# Altium project SAM_E54_Xplained_Pro.PrjPCB (part 2 of 4)

## Sheet SAM_E54_Xplained_Pro_triple_input_power_supply_HSW.SchDoc: Power supply
size A3; Organization: ATMEL Norway; Address1: Vestre Rosten 79; Address2: N-7075 TILLER; Address3: NORWAY; DocumentNumber: A09-2748; Revision: 4; SheetNumber: 2; SheetTotal: 13; PageSetup: Record=PageOptions|CenterHorizontal=True|CenterVertical=True|PrintScale=1.01|XCorrection=1.00|YCorrection=1.00|PrintKind=1|BorderSize=5000000|LeftOffset=0|BottomOffset=0|Orientation=2|PaperLength=1000|PaperWidth=1000|Scale=100|PaperSource=7|PrintQuality=-4|MediaType=1|DitherType=10|PaperKind=A3 (297 x 420 mm)|PrintScaleMode=1
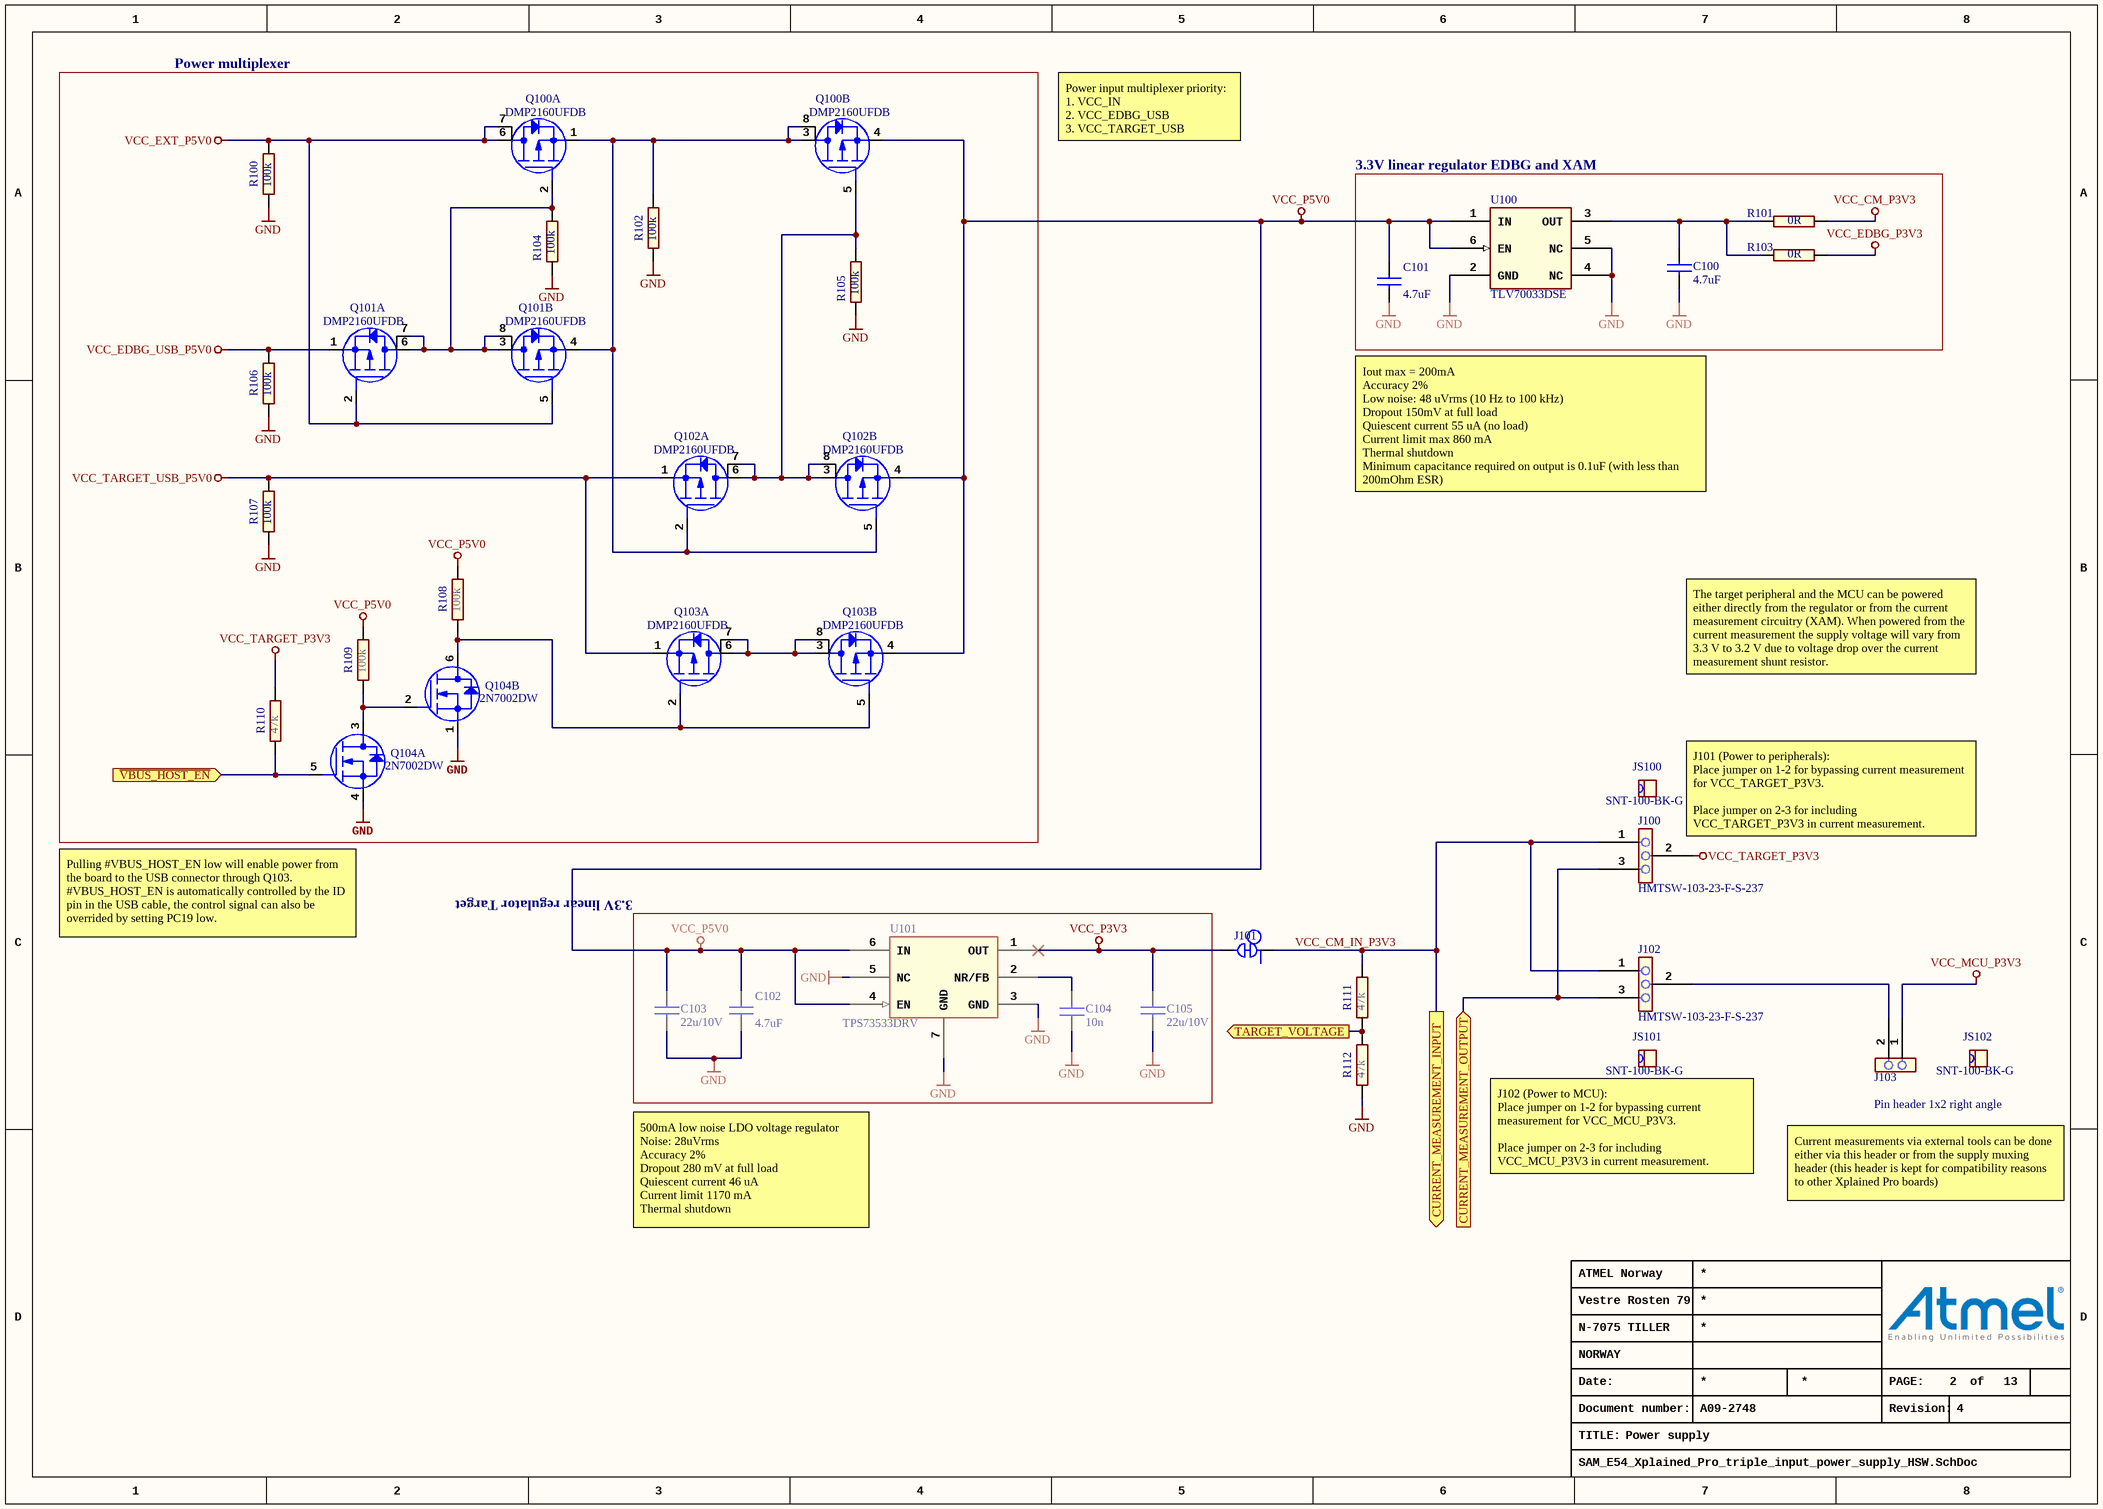
[diagram p4: SAM_E54_Xplained_Pro_triple_input_power_supply_HSW.SchDoc]

### Parts
C100  value 4.7uF  [AP1-00117]
C101  value 4.7uF  [AP1-00117]
C102  value 4.7uF  [AP1-00117]
C103  value 22u/10V  [AP1-00117]
C104  value 10n  [AP1-00053]
C105  value 22u/10V  [AP1-00117]
J100  value HMTSW-103-23-F-S-237  [AP8-00745]
J101  (no value)  [AP9-00044]  (net tie, no BOM)
J102  value HMTSW-103-23-F-S-237  [AP8-00745]
J103  value Pin header 1x2 right angle  [AP8-00367]
JS100  value SNT-100-BK-G  [AP8-00525]
JS101  value SNT-100-BK-G  [AP8-00525]
JS102  value SNT-100-BK-G  [AP8-00525]
Q100  value DMP2160UFDB  [AP5-00047]  (parts A,B of 2)
Q101  value DMP2160UFDB  [AP5-00047]  (parts A,B of 2)
Q102  value DMP2160UFDB  [AP5-00047]  (parts A,B of 2)
Q103  value DMP2160UFDB  [AP5-00047]  (parts A,B of 2)
Q104  value 2N7002DW  [AP5-00001]  (hidden comment: Same as 2N7002 but with two MOSFETs in one package)  (parts A,B of 2)
R100  value 100k  [AP2-00011]
R101  value 0R  [AP2-00011]
R102  value 100k  [AP2-00011]
R103  value 0R  [AP2-00011]
R104  value 100k  [AP2-00011]
R105  value 100k  [AP2-00011]
R106  value 100k  [AP2-00011]
R107  value 100k  [AP2-00011]
R108  value 100k  [AP2-00011]
R109  value 100k  [AP2-00011]
R110  value 47k  [AP2-00011]
R111  value 47k  [AP2-00011]
R112  value 47k  [AP2-00011]
U100  value TLV70033DSE  [AP6-00262]
U101  value TPS73533DRV  [AP6-00162]

### Blocks framed on the sheet
Power multiplexer: Q100-Q104 R100 R102 R104-R110
3.3V linear regulator EDBG and XAM: C100 C101 R101 R103 U100
3.3V linear regulator Target: C102-C105 U101

### Ports
CURRENT_MEASUREMENT_INPUT (out), CURRENT_MEASUREMENT_OUTPUT (in), TARGET_VOLTAGE (out), ~{VBUS_HOST_EN} (in)

### Nets
GND: C100.2 C101.2 C102.2 C103.2 C104.1 C105.2 Q104.1(S2) Q104.4(S1) R100.1 R102.1 R104.2 R105.1 R106.1 R107.1 R112.1 U100.2(GND) U100.4(NC) U100.5(NC) U101.3(GND) U101.5(NC) U101.7(GND)
VCC_CM_P3V3: R101.1
VCC_EDBG_P3V3: R103.1
VCC_EDBG_USB_P5V0: Q101.1(S1) R106.2
VCC_EXT_P5V0: Q100.6(D1) Q100.7(D1_PAD) Q101.2(G1) Q101.5(G2) R100.2
VCC_MCU_P3V3: J103.1
VCC_P3V3: C105.1 J101.2 U101.1(OUT)
VCC_P5V0: C101.1 C102.1 C103.1 Q100.4(S2) Q102.4(S2) Q103.4(S2) R108.2 R109.2 U100.1(IN) U100.6(EN) U101.4(EN) U101.6(IN)
VCC_TARGET_P3V3: J100.2 R110.2
VCC_TARGET_USB_P5V0: Q102.1(S1) Q103.1(S1) R107.2
CM_PA09_AIN17: R111.1 R112.2 ; port TARGET_VOLTAGE
VCC_CM_IN_P3V3: J100.1 J101.1 J102.1 R111.2 ; port CURRENT_MEASUREMENT_INPUT
NetC100_1: C100.1 R101.2 R103.2 U100.3(OUT)
NetC104_2: C104.2 U101.2(NR/FB)
NetJ100_3: J100.3 J102.3 ; port CURRENT_MEASUREMENT_OUTPUT
NetJ102_2: J102.2 J103.2
NetJ303_4: Q104.5(G1) R110.1 ; port ~{VBUS_HOST_EN}
NetQ100_1: Q100.1(S1) Q100.3(D2) Q100.8(D2_PAD) Q101.4(S2) Q102.2(G1) Q102.5(G2) R102.2
NetQ100_2: Q100.2(G1) Q101.3(D2) Q101.6(D1) Q101.7(D1_PAD) Q101.8(D2_PAD) R104.1
NetQ100_5: Q100.5(G2) Q102.3(D2) Q102.6(D1) Q102.7(D1_PAD) Q102.8(D2_PAD) R105.2
NetQ103_2: Q103.2(G1) Q103.5(G2) Q104.6(D2) R108.1
NetQ103_3: Q103.3(D2) Q103.6(D1) Q103.7(D1_PAD) Q103.8(D2_PAD)
NetQ104_2: Q104.2(G2) Q104.3(D1) R109.1

### Notes on the sheet
- Power input multiplexer priority:
  1. VCC_IN
  2. VCC_EDBG_USB
  3. VCC_TARGET_USB
- Iout max = 200mA
  Accuracy 2%
  Low noise: 48 uVrms (10 Hz to 100 kHz)
  Dropout 150mV at full load
  Quiescent current 55 uA (no load)
  Current limit max 860 mA
  Thermal shutdown
  Minimum capacitance required on output is 0.1uF (with less than 200mOhm ESR)
- The target peripheral and the MCU can be powered either directly from the regulator or from the current measurement circuitry (XAM). When powered from the current measurement the supply voltage will vary from 3.3 V to 3.2 V due to voltage drop over the current measurement shunt resistor.
- J101 (Power to peripherals):
  Place jumper on 1-2 for bypassing current measurement for VCC_TARGET_P3V3.
  Place jumper on 2-3 for including VCC_TARGET_P3V3 in current measurement.
- Pulling #VBUS_HOST_EN low will enable power from the board to the USB connector through Q103.
  #VBUS_HOST_EN is automatically controlled by the ID pin in the USB cable, the control signal can also be overrided by setting PC19 low.
- (near JS101) J102 (Power to MCU):
  Place jumper on 1-2 for bypassing current measurement for VCC_MCU_P3V3.
  Place jumper on 2-3 for including VCC_MCU_P3V3 in current measurement.
- 500mA low noise LDO voltage regulator
  Noise: 28uVrms
  Accuracy 2%
  Dropout 280 mV at full load
  Quiescent current 46 uA
  Current limit 1170 mA
  Thermal shutdown
- Current measurements via external tools can be done either via this header or from the supply muxing header (this header is kept for compatibility reasons to other Xplained Pro boards)
- Date:
- PAGE:
- of
- TITLE:
- Document number:
- Revision:

### Library data of the parts
C100-C102 = A01-0377: Ceramic capacitor, SMD 0603, X5R, 10V, 10% (de31036); PartGroup: Capacitors,Ceramic,SMD 0603; Manufacturer: WALSIN Technology Corporation; MPN: 0603X475K100CT; TemperatureRange: -55 - +85 deg C; AN: A01-0377; Tolerance: 10%; Height: 0,800000011920929
C103 C105 = A01-0791: Ceramic capacitor, SMD 0603, X5R,10V, Â±20%; PartGroup: Capacitors,Ceramic,SMD 0603; Manufacturer: Murata; MPN: GRM188R61A226ME15D; AN: A01-0791; Tolerance: Â±20%
C104 = A01-0050: Ceramic capacitor, SMD 0402, X7R, 25V, +/-10%; PartGroup: Capacitors,Ceramic,SMD 0402; Manufacturer: YAGEO CORP; MPN: CC0402KRX7R8BB103; TemperatureRange: -55 - +125 deg C; AN: A01-0050; Tolerance: 25V, +/-10%; Height: 0,550000011920929
J100 J102 = A08-1799: 1x3 pin header, 2.54mm pitch, Pin-in-Paste THM, 1mm hole; PartGroup: Mechanical devices,Connectors,Pin headers; Manufacturer: SAMTEC; AN: A08-1799; Height: 6,09999990463257; MPN: HMTSW-103-23-F-S-237
J101 = A09-0783: Default closed SMD strap, 0603 size; PartGroup: Mechanical devices,PCB implemented components; Value: SMD-STRAP_0603_CLOSED; AN: A09-0783; Height: 0
J103 = A08-0764: 1x2 pin header, right angle, 2.54 mm pitch, through-hole; PartGroup: Mechanical devices,Connectors,Pin headers; Manufacturer: Pro-data International Corp; MPN: 2213R-2G; AN: A08-0764; Height: 2,53999996185303
JS100-JS102 = A08-0543: Jumper cap for 2.54mm pinheader; PartGroup: Mechanical devices,Mounting accessories,Other; Manufacturer: SAMTEC; AN: A08-0543; MPN: SNT-100-BK-G
Q100-Q103 = A05-0171: MOSFET 20V 3.8A DUAL P-CHAN, Rds 70 mOhms, Vgs 12V, Vds -20; PartGroup: Transistors,Power FET,SMD; Manufacturer: Diodes Incorporated; MPN: DMP2160UFDB-7; TemperatureRange: -55 C to +150 C; AN: A05-0171; Height: 0,605000019073486
Q104 = A05-0051: Dual N-Channel MOSFET, 60V, 115mA cont,RDS(ON) < 7.5 Ohm @50mA@5V, SOT-363; PartGroup: Transistors,Small signal FET,SMD; Manufacturer: Fairchild; TemperatureRange: -65 to 150 deg C; AN: A05-0051; Height: 1,10000002384186; MPN: 2N7002DW
R100 R102 R104-R109 = A02-0260: Thick film resistor, SMD 0402, 1/16W, 1%; PartGroup: Resistors,SMD,0402 1%; Manufacturer: ASJ; MPN: CR10-1003-FK; TemperatureRange: -55ï¿½ to +125ï¿½C; AN: A02-0260; Tolerance: 1 %; Height: 0,349999994039536
R101 R103 = A02-0163: RES 0.0 OHM 1/16W 0402 SMD; PartGroup: Resistors,SMD,0402 1%; Manufacturer: (n/a); MPN: RMCF0402ZT0R00; Tolerance: 1 %; TemperatureRange: -55 - +125 deg C; AN: A02-0163; Height: 0,349999994039536
R110-R112 = A02-0252: Thick film resistor, SMD 0402, 1/16W, 1%; PartGroup: Resistors,SMD,0402 1%; Manufacturer: KOA; MPN: RK73H1ETTP4702F; TemperatureRange: -55 - +125 deg C; AN: A02-0252; Tolerance: 1 %; Height: 0,349999994039536
U100 = A06-0719: LDO, 200 mA, Iq=31 uA, Vdo=250mV, Vout=3.3V, VIN= 2 V to 5.5V, SON-6 package; PartGroup: Integrated Circuits,Regulators,Linear; Manufacturer: Texas Instruments; AN: A06-0719; Height: 0,800000011920929; MPN: TLV70033DSE
U101 = A06-1135: Low noise LDO, 500 mA, Vout=3.3V, 2% accuracy, IQ=46uA, noise=28uVrms, VIN= 2.7V to 6.5V, Vdo=280mV,stable with low ESR capacitor; PartGroup: Integrated Circuits,Regulators,Linear; Manufacturer: Texas Instruments; AN: A06-1135; Height: 0,75; MPN: TPS73533DRV

## Sheet SAM_E54_Xplained_Pro_current_measurement.SchDoc: Current measurement
size A3; Organization: ATMEL Norway; Address1: Vestre Rosten 79; Address2: N-7075 TILLER; Address3: NORWAY; DocumentNumber: A09-2748; Revision: 4; SheetNumber: 10; SheetTotal: 13; PageSetup: Record=PageOptions|CenterHorizontal=True|CenterVertical=True|PrintScale=1.01|XCorrection=1.00|YCorrection=1.00|PrintKind=1|BorderSize=5000000|LeftOffset=0|BottomOffset=0|Orientation=2|PaperLength=1000|PaperWidth=1000|Scale=100|PaperSource=7|PrintQuality=-4|MediaType=1|DitherType=10|PaperKind=A3 (297 x 420 mm)|PrintScaleMode=1
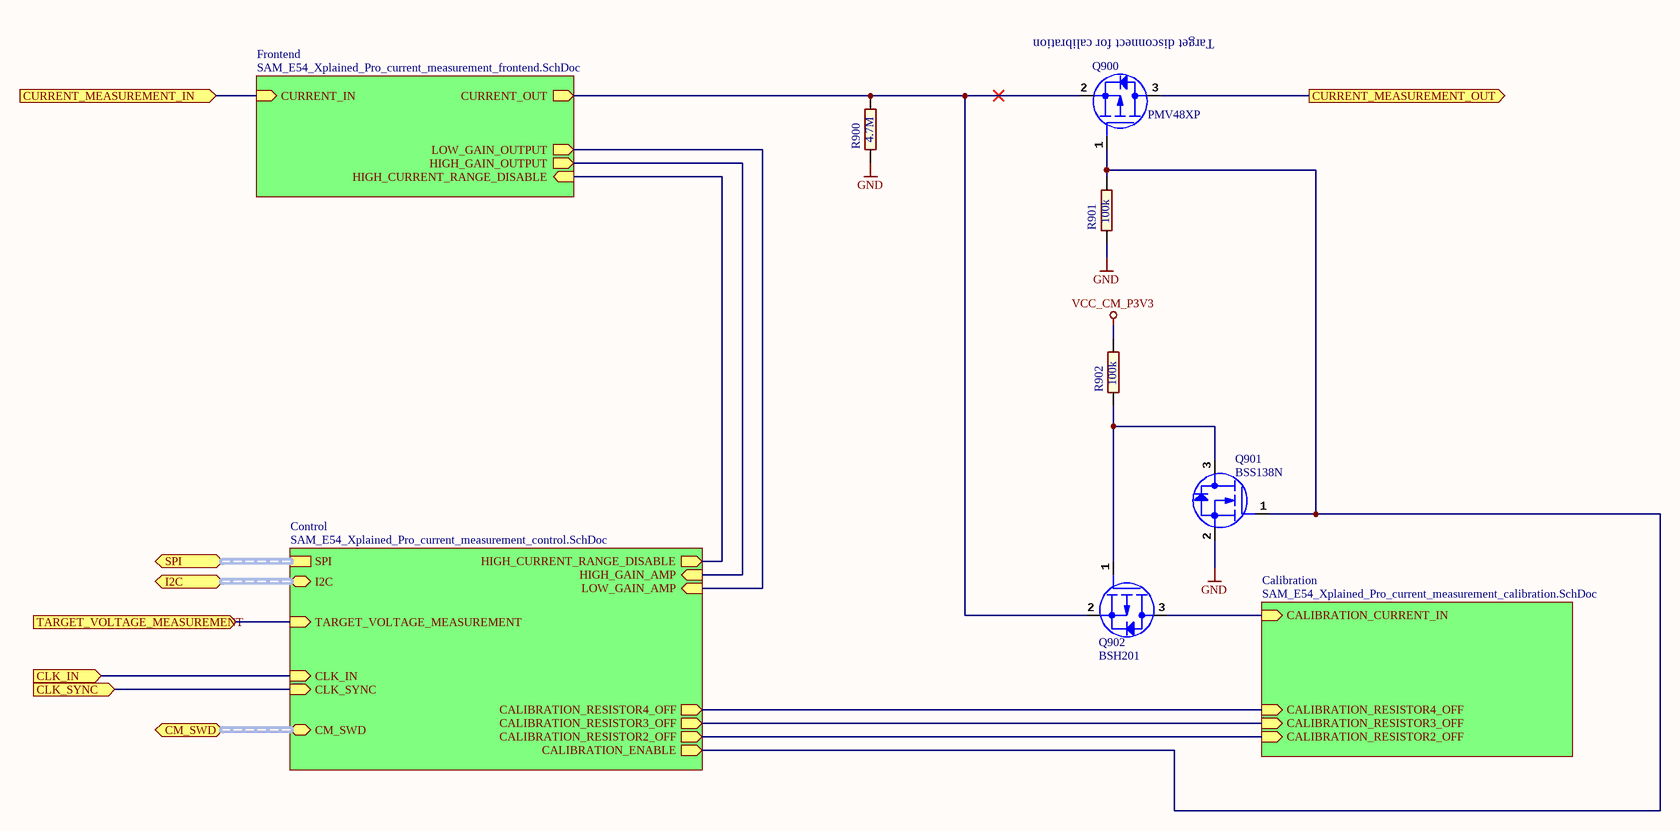
[diagram p5: SAM_E54_Xplained_Pro_current_measurement.SchDoc]

### Parts
Q900  value PMV48XP  [AP5-00002]
Q901  value BSS138N  [AP5-00002]
Q902  value BSH201  [AP5-00002]
R900  value 4.7M  [AP2-00011]
R901  value 100k  [AP2-00011]
R902  value 100k  [AP2-00011]

### Sub-sheets
Calibration = SAM_E54_Xplained_Pro_current_measurement_calibration.SchDoc: CALIBRATION_RESISTOR2_OFF (in), CALIBRATION_RESISTOR3_OFF (in), CALIBRATION_RESISTOR4_OFF (in), CALIBRATION_CURRENT_IN (in)
Control = SAM_E54_Xplained_Pro_current_measurement_control.SchDoc: LOW_GAIN_AMP (in), HIGH_GAIN_AMP (in), HIGH_CURRENT_RANGE_DISABLE (out), SPI (harness SPI), CALIBRATION_RESISTOR3_OFF (out), CALIBRATION_RESISTOR2_OFF (out), CALIBRATION_ENABLE (out), CALIBRATION_RESISTOR4_OFF (out), I2C (harness I2C), CLK_IN (in), CLK_SYNC (in), TARGET_VOLTAGE_MEASUREMENT (in), CM_SWD (harness SWD)
Frontend = SAM_E54_Xplained_Pro_current_measurement_frontend.SchDoc: CURRENT_OUT (out), CURRENT_IN (in), LOW_GAIN_OUTPUT (out), HIGH_GAIN_OUTPUT (out), HIGH_CURRENT_RANGE_DISABLE (in)

### Ports
CLK_IN (in), CLK_SYNC (in), CM_SWD (harness SWD), CURRENT_MEASUREMENT_IN (in), CURRENT_MEASUREMENT_OUT (out), I2C (harness I2C), SPI (harness SPI), TARGET_VOLTAGE_MEASUREMENT (in)

### Nets
GND: Q901.2(S) R900.1 R901.1
VCC_CM_P3V3: R902.2
CM_PA00_GPIO: sheet Calibration/CALIBRATION_RESISTOR3_OFF, sheet Control/CALIBRATION_RESISTOR3_OFF
CM_PA01_GPIO: sheet Calibration/CALIBRATION_RESISTOR4_OFF, sheet Control/CALIBRATION_RESISTOR4_OFF
CM_PA05_AIN5: sheet Control/LOW_GAIN_AMP, sheet Frontend/LOW_GAIN_OUTPUT
CM_PA08_AIN16: sheet Control/HIGH_GAIN_AMP, sheet Frontend/HIGH_GAIN_OUTPUT
CM_PA09_AIN17: port TARGET_VOLTAGE_MEASUREMENT, sheet Control/TARGET_VOLTAGE_MEASUREMENT
CM_PA10_GPIO: Q900.1(G) Q901.1(G) R901.2 ; sheet Control/CALIBRATION_ENABLE
CM_PA11_GCLK5: port CLK_SYNC, sheet Control/CLK_SYNC
CM_PA14_GCLK0: port CLK_IN, sheet Control/CLK_IN
CM_PA15_GPIO: sheet Calibration/CALIBRATION_RESISTOR2_OFF, sheet Control/CALIBRATION_RESISTOR2_OFF
CM_PA18_CMP0: sheet Control/HIGH_CURRENT_RANGE_DISABLE, sheet Frontend/HIGH_CURRENT_RANGE_DISABLE
VCC_CM_IN_P3V3: port CURRENT_MEASUREMENT_IN, sheet Frontend/CURRENT_IN
NetJ100_3: Q900.3(D) ; port CURRENT_MEASUREMENT_OUT
NetQ900_2: Q900.2(S) Q902.2(S) R900.2 ; sheet Frontend/CURRENT_OUT
NetQ901_3: Q901.3(D) Q902.1(G) R902.1
NetQ902_3: Q902.3(D) ; sheet Calibration/CALIBRATION_CURRENT_IN

### Buses and harness runs
harness port CM_SWD = sheet Control/CM_SWD
harness port I2C = sheet Control/I2C
harness port SPI = sheet Control/SPI

### Notes on the sheet
- (near Q900) Target disconnect for calibration
- Date:
- PAGE:
- of
- TITLE:
- Document number:
- Revision:

### Library data of the parts
Q900 = A05-0130: P-Channel Digital FET. -30V, -3.5A continuous, -14A Peak. RDS(ON)=48mOhm@VGS=-4.5V, RDS(ON)=71mOhm@VGS=-2.5V. VGS(th)<1.25V; PartGroup: Transistors,Power FET,SMD; Manufacturer: NXP; MPN: PMV48XP,215; TemperatureRange: -55Â°C to +150Â°C; AN: A05-0130
Q901 = A05-0140: Low leakage N-Channel MOSFET. 60V, 0.23A continuous, 0.92A Peak. RDS(ON) = 3.5Ohm@VGS=4.5V, VGS(th)<1.4V; PartGroup: Transistors,Small signal FET,SMD; Manufacturer: Infineon; TemperatureRange: -55  to +150 deg celcius; AN: A05-0140; Height: 1,10000002384186; MPN: BSS138N
Q902 = A05-0132: P-Channel Digital FET. -60V, -0.3A continuous, -1.2A Peak. RDS(ON)=2.5@VGS=-10V, RDS(ON)=<5 ohm @VGS=-2.5V. VGS(th)<1.9V; PartGroup: Transistors,Small signal FET,SMD; Manufacturer: NXP; MPN: BSH201,215; AN: A05-0132
R900 = A02-0884: Thick film SMD 0402 1/16W 1%; PartGroup: Resistors,SMD,0402 1%; Manufacturer: YAGEO CORP; MPN: RC0402FR-074M7L; TemperatureRange: -55 Â°C to +155 Â°C; AN: A02-0884; Tolerance: 1 %
R901 R902 = A02-0260: as R100 on sheet SAM_E54_Xplained_Pro_triple_input_power_supply_HSW; AN: A02-0260; Tolerance: 1 %; Height: 0,349999994039536

## Sheet SAM_E54_Xplained_Pro_current_measurement_calibration.SchDoc: Current measurement calibration
size A3; Organization: ATMEL Norway; Address1: Vestre Rosten 79; Address2: N-7075 TILLER; Address3: NORWAY; DocumentNumber: A09-2748; Revision: 4; SheetNumber: 11; SheetTotal: 13; PageSetup: Record=PageOptions|CenterHorizontal=True|CenterVertical=True|PrintScale=1.01|XCorrection=1.00|YCorrection=1.00|PrintKind=1|BorderSize=5000000|LeftOffset=0|BottomOffset=0|Orientation=2|PaperLength=1000|PaperWidth=1000|Scale=100|PaperSource=7|PrintQuality=-4|MediaType=1|DitherType=10|PaperKind=A3 (297 x 420 mm)|PrintScaleMode=1
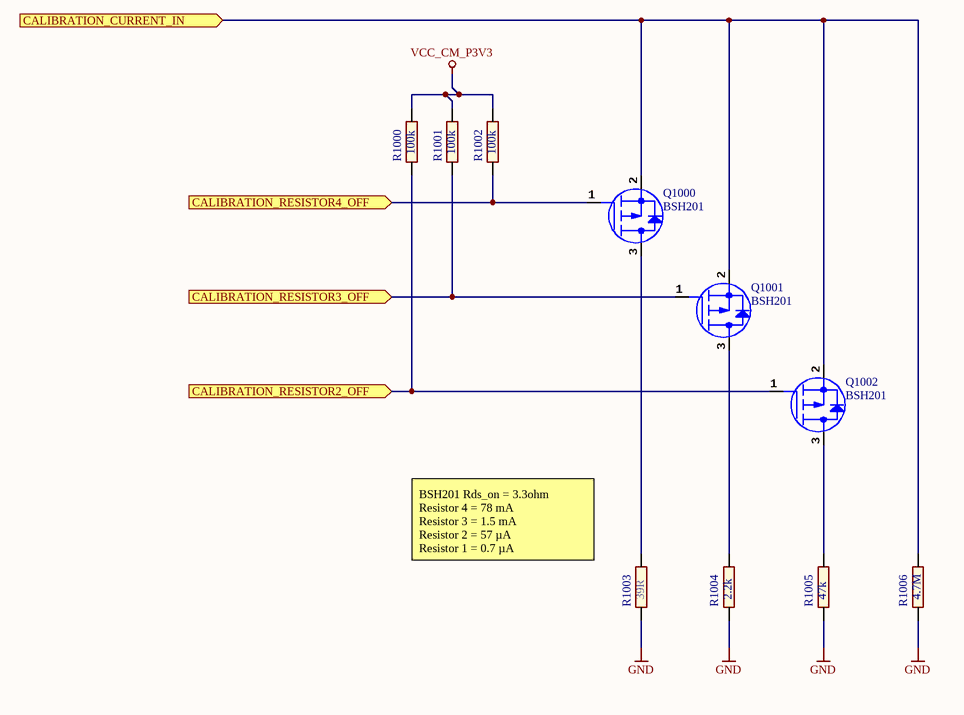
[diagram p6: SAM_E54_Xplained_Pro_current_measurement_calibration.SchDoc]

### Parts
Q1000  value BSH201  [AP5-00002]
Q1001  value BSH201  [AP5-00002]
Q1002  value BSH201  [AP5-00002]
R1000  value 100k  [AP2-00011]
R1001  value 100k  [AP2-00011]
R1002  value 100k  [AP2-00011]
R1003  value 39R  [AP2-00011]
R1004  value 2.2k  [AP2-00011]
R1005  value 47k  [AP2-00011]
R1006  value 4.7M  [AP2-00011]

### Ports
CALIBRATION_CURRENT_IN (in), CALIBRATION_RESISTOR2_OFF (in), CALIBRATION_RESISTOR3_OFF (in), CALIBRATION_RESISTOR4_OFF (in)

### Nets
GND: R1003.1 R1004.1 R1005.1 R1006.1
VCC_CM_P3V3: R1000.2 R1001.2 R1002.2
CM_PA00_GPIO: Q1001.1(G) R1001.1 ; port CALIBRATION_RESISTOR3_OFF
CM_PA01_GPIO: Q1000.1(G) R1002.1 ; port CALIBRATION_RESISTOR4_OFF
CM_PA15_GPIO: Q1002.1(G) R1000.1 ; port CALIBRATION_RESISTOR2_OFF
NetQ902_3: Q1000.2(S) Q1001.2(S) Q1002.2(S) R1006.2 ; port CALIBRATION_CURRENT_IN
NetQ1000_3: Q1000.3(D) R1003.2
NetQ1001_3: Q1001.3(D) R1004.2
NetQ1002_3: Q1002.3(D) R1005.2

### Notes on the sheet
- (near R1003) BSH201 Rds_on = 3.3ohm
  Resistor 4 = 78 mA
  Resistor 3 = 1.5 mA
  Resistor 2 = 57 µA
  Resistor 1 = 0.7 µA
- Date:
- PAGE:
- of
- TITLE:
- Document number:
- Revision:

### Library data of the parts
Q1000-Q1002 = A05-0132: as Q902 on sheet SAM_E54_Xplained_Pro_current_measurement; AN: A05-0132
R1000-R1002 = A02-0260: as R100 on sheet SAM_E54_Xplained_Pro_triple_input_power_supply_HSW; AN: A02-0260; Tolerance: 1 %; Height: 0,349999994039536
R1003 = A02-0178: Thick film resistor, SMD 0402, 1/16W, 1%; PartGroup: Resistors,SMD,0402 1%; Manufacturer: ASJ; MPN: CR10-39R0-FK; TemperatureRange: -55 - +125 deg C; AN: A02-0178; Tolerance: 1 %; Height: 0,349999994039536
R1004 = A02-0220: Thick film resistor, SMD 0402, 1/16W, 1%; PartGroup: Resistors,SMD,0402 1%; Manufacturer: ASJ; MPN: CR10-2201-FK; TemperatureRange: -55 - +125 deg C; AN: A02-0220; Tolerance: 1 %; Height: 0,349999994039536
R1005 = A02-0252: as R110 on sheet SAM_E54_Xplained_Pro_triple_input_power_supply_HSW; AN: A02-0252; Tolerance: 1 %; Height: 0,349999994039536
R1006 = A02-0884: as R900 on sheet SAM_E54_Xplained_Pro_current_measurement; AN: A02-0884; Tolerance: 1 %

## Sheet SAM_E54_Xplained_Pro_current_measurement_control.SchDoc: Current measurement control
size A3; Organization: ATMEL Norway; Address1: Vestre Rosten 79; Address2: N-7075 TILLER; Address3: NORWAY; DocumentNumber: A09-2748; Revision: 4; SheetNumber: 12; SheetTotal: 13; PageSetup: Record=PageOptions|CenterHorizontal=True|CenterVertical=True|PrintScale=1.01|XCorrection=1.00|YCorrection=1.00|PrintKind=1|BorderSize=5000000|LeftOffset=0|BottomOffset=0|Orientation=2|PaperLength=1000|PaperWidth=1000|Scale=100|PaperSource=7|PrintQuality=-4|MediaType=1|DitherType=10|PaperKind=A3 (297 x 420 mm)|PrintScaleMode=1
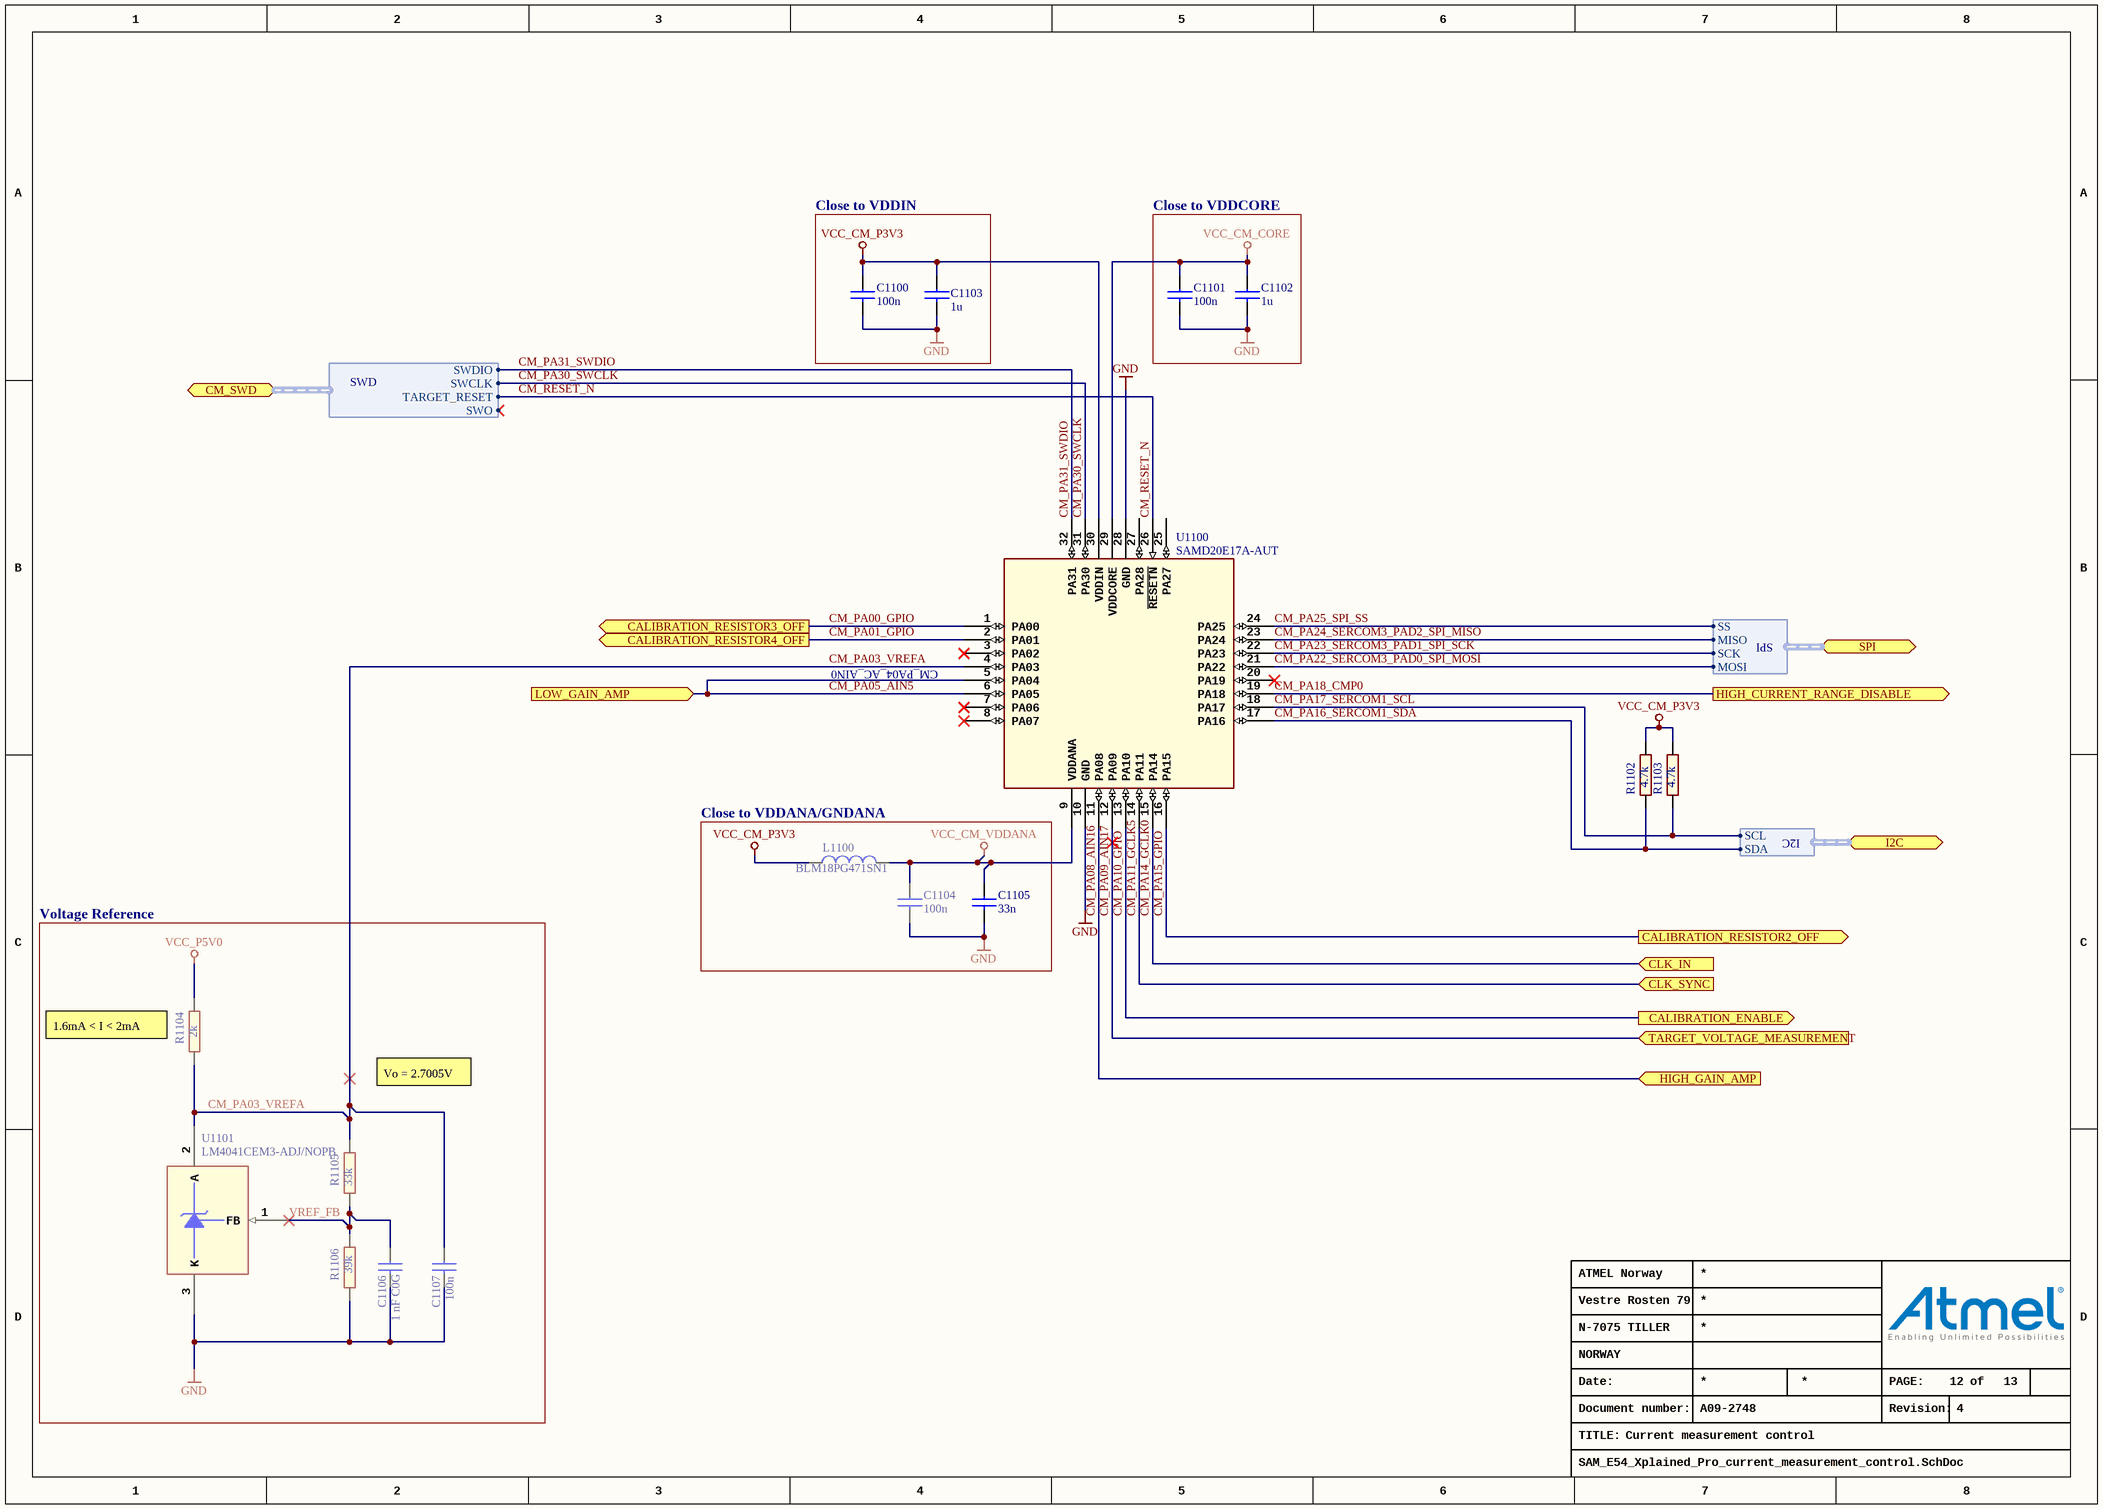
[diagram p7: SAM_E54_Xplained_Pro_current_measurement_control.SchDoc]

### Parts
C1100  value 100n  [AP1-00053]
C1101  value 100n  [AP1-00053]
C1102  value 1u  [AP1-00053]
C1103  value 1u  [AP1-00053]
C1104  value 100n  [AP1-00053]
C1105  value 33n  [AP1-00053]
C1106  value 1 nF C0G  [AP1-00053]
C1107  value 100n  [AP1-00053]
L1100  value BLM18PG471SN1  [AP3-00005]
R1102  value 4.7k  [AP2-00011]
R1103  value 4.7k  [AP2-00011]
R1104  value 2k  [AP2-00011]
R1105  value 33k  [AP2-00011]
R1106  value 39k  [AP2-00011]
U1100  value SAMD20E17A-AUT  [AP6-00061]
U1101  value LM4041CEM3-ADJ/NOPB  [AP5-00002]

### Blocks framed on the sheet
Close to VDDIN: C1100 C1103
Close to VDDCORE: C1101 C1102
Close to VDDANA/GNDANA: C1104 C1105 L1100
Voltage Reference: C1106 C1107 R1104-R1106 U1101

### Ports
CALIBRATION_ENABLE (out), CALIBRATION_RESISTOR2_OFF (out), CALIBRATION_RESISTOR3_OFF (out), CALIBRATION_RESISTOR4_OFF (out), CLK_IN (in), CLK_SYNC (in), CM_SWD (harness SWD), HIGH_CURRENT_RANGE_DISABLE (out), HIGH_GAIN_AMP (in), I2C (harness I2C), LOW_GAIN_AMP (in), SPI (harness SPI), TARGET_VOLTAGE_MEASUREMENT (in)

### Harnesses
SPI: MISO, MOSI, SCK, SS
I2C: SCL, SDA
SWD: SWCLK, SWDIO, TARGET_RESET, SWO

### Nets
GND: C1100.2 C1101.2 C1102.2 C1103.2 C1104.2 C1105.2 C1106.2 C1107.2 R1106.1 U1100.10(GND) U1100.28(GND) U1101.3(K)
VCC_CM_CORE: C1101.1 C1102.1 U1100.29(VDDCORE)
VCC_CM_P3V3: C1100.1 C1103.1 L1100.1 R1102.2 R1103.2 U1100.30(VDDIN)
VCC_CM_VDDANA: C1104.1 C1105.1 L1100.2 U1100.9(VDDANA)
VCC_P5V0: R1104.2
CM_PA00_GPIO: U1100.1(PA00) ; port CALIBRATION_RESISTOR3_OFF
CM_PA01_GPIO: U1100.2(PA01) ; port CALIBRATION_RESISTOR4_OFF
CM_PA03_VREFA: C1107.1 R1104.1 R1105.2 U1100.4(PA03) U1101.2(A)
CM_PA05_AIN5: U1100.5(PA04) U1100.6(PA05) ; port LOW_GAIN_AMP
CM_PA08_AIN16: U1100.11(PA08) ; port HIGH_GAIN_AMP
CM_PA09_AIN17: U1100.12(PA09) ; port TARGET_VOLTAGE_MEASUREMENT
CM_PA10_GPIO: U1100.13(PA10) ; port CALIBRATION_ENABLE
CM_PA11_GCLK5: U1100.14(PA11) ; port CLK_SYNC
CM_PA14_GCLK0: U1100.15(PA14) ; port CLK_IN
CM_PA15_GPIO: U1100.16(PA15) ; port CALIBRATION_RESISTOR2_OFF
CM_PA16_SERCOM1_SDA: R1102.1 U1100.17(PA16) ; port I2C.SDA
CM_PA17_SERCOM1_SCL: R1103.1 U1100.18(PA17) ; port I2C.SCL
CM_PA18_CMP0: U1100.19(PA18) ; port HIGH_CURRENT_RANGE_DISABLE
CM_PA22_SERCOM3_PAD0_SPI_MOSI: U1100.21(PA22) ; port SPI.MOSI
CM_PA23_SERCOM3_PAD1_SPI_SCK: U1100.22(PA23) ; port SPI.SCK
CM_PA24_SERCOM3_PAD2_SPI_MISO: U1100.23(PA24) ; port SPI.MISO
CM_PA25_SPI_SS: U1100.24(PA25) ; port SPI.SS
CM_PA30_SWCLK: U1100.31(PA30) ; port CM_SWD.SWCLK
CM_PA31_SWDIO: U1100.32(PA31) ; port CM_SWD.SWDIO
CM_RESET_N: U1100.26(~{RESETN}) ; port CM_SWD.TARGET_RESET
VREF_FB: C1106.1 R1105.1 R1106.2 U1101.1(FB)

Not connected (* = marked no-connect by the designer): U1100 3(PA02)* 7(PA06)* 8(PA07)* 20(PA19)* 25(PA27) 27(PA28)

### Notes on the sheet
- CM_PA04_AC_AIN0
- (near R1104) 1.6mA < I < 2mA
- Vo = 2.7005V
- Date:
- PAGE:
- of
- TITLE:
- Document number:
- Revision:

### Library data of the parts
C1100 C1101 C1104 C1107 = A01-0246: Ceramic capacitor, SMD 0402, X7R, 16V, +/-10%; PartGroup: Capacitors,Ceramic,SMD 0402; Manufacturer: Kemet; MPN: C0402C104K4RACTU; TemperatureRange: -55 - +125 deg C; AN: A01-0246; Tolerance: 16V, +/-10%; Height: 0,5
C1102 C1103 = A01-0286: Ceramic capacitor, SMD 0402, X5R, 6.3V, +/-10% (de26942); PartGroup: Capacitors,Ceramic,SMD 0402; Manufacturer: Kemet; MPN: C0402C105K9PAC; TemperatureRange: -55 to 85 deg C; AN: A01-0286; Tolerance: +/-10%; Height: 0,5
C1105 = A01-0397: Ceramic capacitor, SMD 0402, X7R, 25V, ±10%; PartGroup: Capacitors,Ceramic,SMD 0402; Manufacturer: Murata; MPN: GRM155R71E333KA88D; Tolerance: ±10%(K); TemperatureRange: -55 to 125°C; AN: A01-0397; Height: 0,5
C1106 = A01-0321: Ceramic capacitor, SMD 0402, C0G, 50V, +/-5%; PartGroup: Capacitors,Ceramic,SMD 0402; Manufacturer: Murata; MPN: GRM1555C1H102JA01D; Tolerance: 5%; AN: A01-0321; Height: 0,550000011920929
L1100 = A03-0035: SMD RF inductor 0603. Z=470Ohm (@100MHz), Max R(dc)=0.65Ohm, Max current=1A; PartGroup: Inductors,EMI; Manufacturer: Murata; TemperatureRange: -55; AN: A03-0035; Height: 0,800000011920929; MPN: BLM18PG471SN1
R1102 R1103 = A02-0228: Thick film resistor, SMD 0402, 1/16W, 1%; PartGroup: Resistors,SMD,0402 1%; Manufacturer: PHYCOMP; MPN: 2322 706 74702L; TemperatureRange: -55ï¿½ to +125ï¿½C; AN: A02-0228; Tolerance: 1 %; Height: 0,349999994039536
R1104 = A02-0219: Thick film resistor, SMD 0402, 1/16W, 1%; PartGroup: Resistors,SMD,0402 1%; TemperatureRange: -55 - +125 deg C; AN: A02-0219; Tolerance: 1 %; Height: 0,349999994039536
R1105 = A02-0248: Thick film resistor, SMD 0402, 1/16W, 1%; PartGroup: Resistors,SMD,0402 1%; Manufacturer: ASJ; MPN: CR10-3302-FK; TemperatureRange: -55 - +125 deg C; AN: A02-0248; Tolerance: 1 %; Height: 0,349999994039536
R1106 = A02-0250: Thick film resistor, SMD 0402, 1/16W, 1%; PartGroup: Resistors,SMD,0402 1%; Manufacturer: ASJ; MPN: CR10-3902-FK; TemperatureRange: -55 - +125 deg C; AN: A02-0250; Tolerance: 1 %; Height: 0,349999994039536
U1100 = A06-1023: Atmel 32bit RISC MCU 32 pin; PartGroup: Integrated Circuits,MCU, MPU, DSP,ARM MCU; MPN: ATSAMD20E17A-AUT; Design comment: *; AN: A06-1023; Height: 1,20000004768372; Manufacturer: ATMEL
U1101 = A06-0123: Adjustable shunt voltage regulator, 1.24 to 10V out; PartGroup: Integrated Circuits,Regulators,Voltage reference; Manufacturer: Texas Instruments; TemperatureRange: -40 to +85 deg. C; AN: A06-0123; Height: 1; MPN: LM4041CEM3-ADJ/NOPB

## Sheet SAM_E54_Xplained_Pro_current_measurement_frontend.SchDoc: Current measurement frontend
size A3; Organization: ATMEL Norway; Address1: Vestre Rosten 79; Address2: N-7075 TILLER; Address3: NORWAY; DocumentNumber: A09-2748; Revision: 4; SheetNumber: 13; SheetTotal: 13; PageSetup: Record=PageOptions|CenterHorizontal=True|CenterVertical=True|PrintScale=1.01|XCorrection=1.00|YCorrection=1.00|PrintKind=1|BorderSize=5000000|LeftOffset=0|BottomOffset=0|Orientation=2|PaperLength=1000|PaperWidth=1000|Scale=100|PaperSource=7|PrintQuality=-4|MediaType=1|DitherType=10|PaperKind=A3 (297 x 420 mm)|PrintScaleMode=1
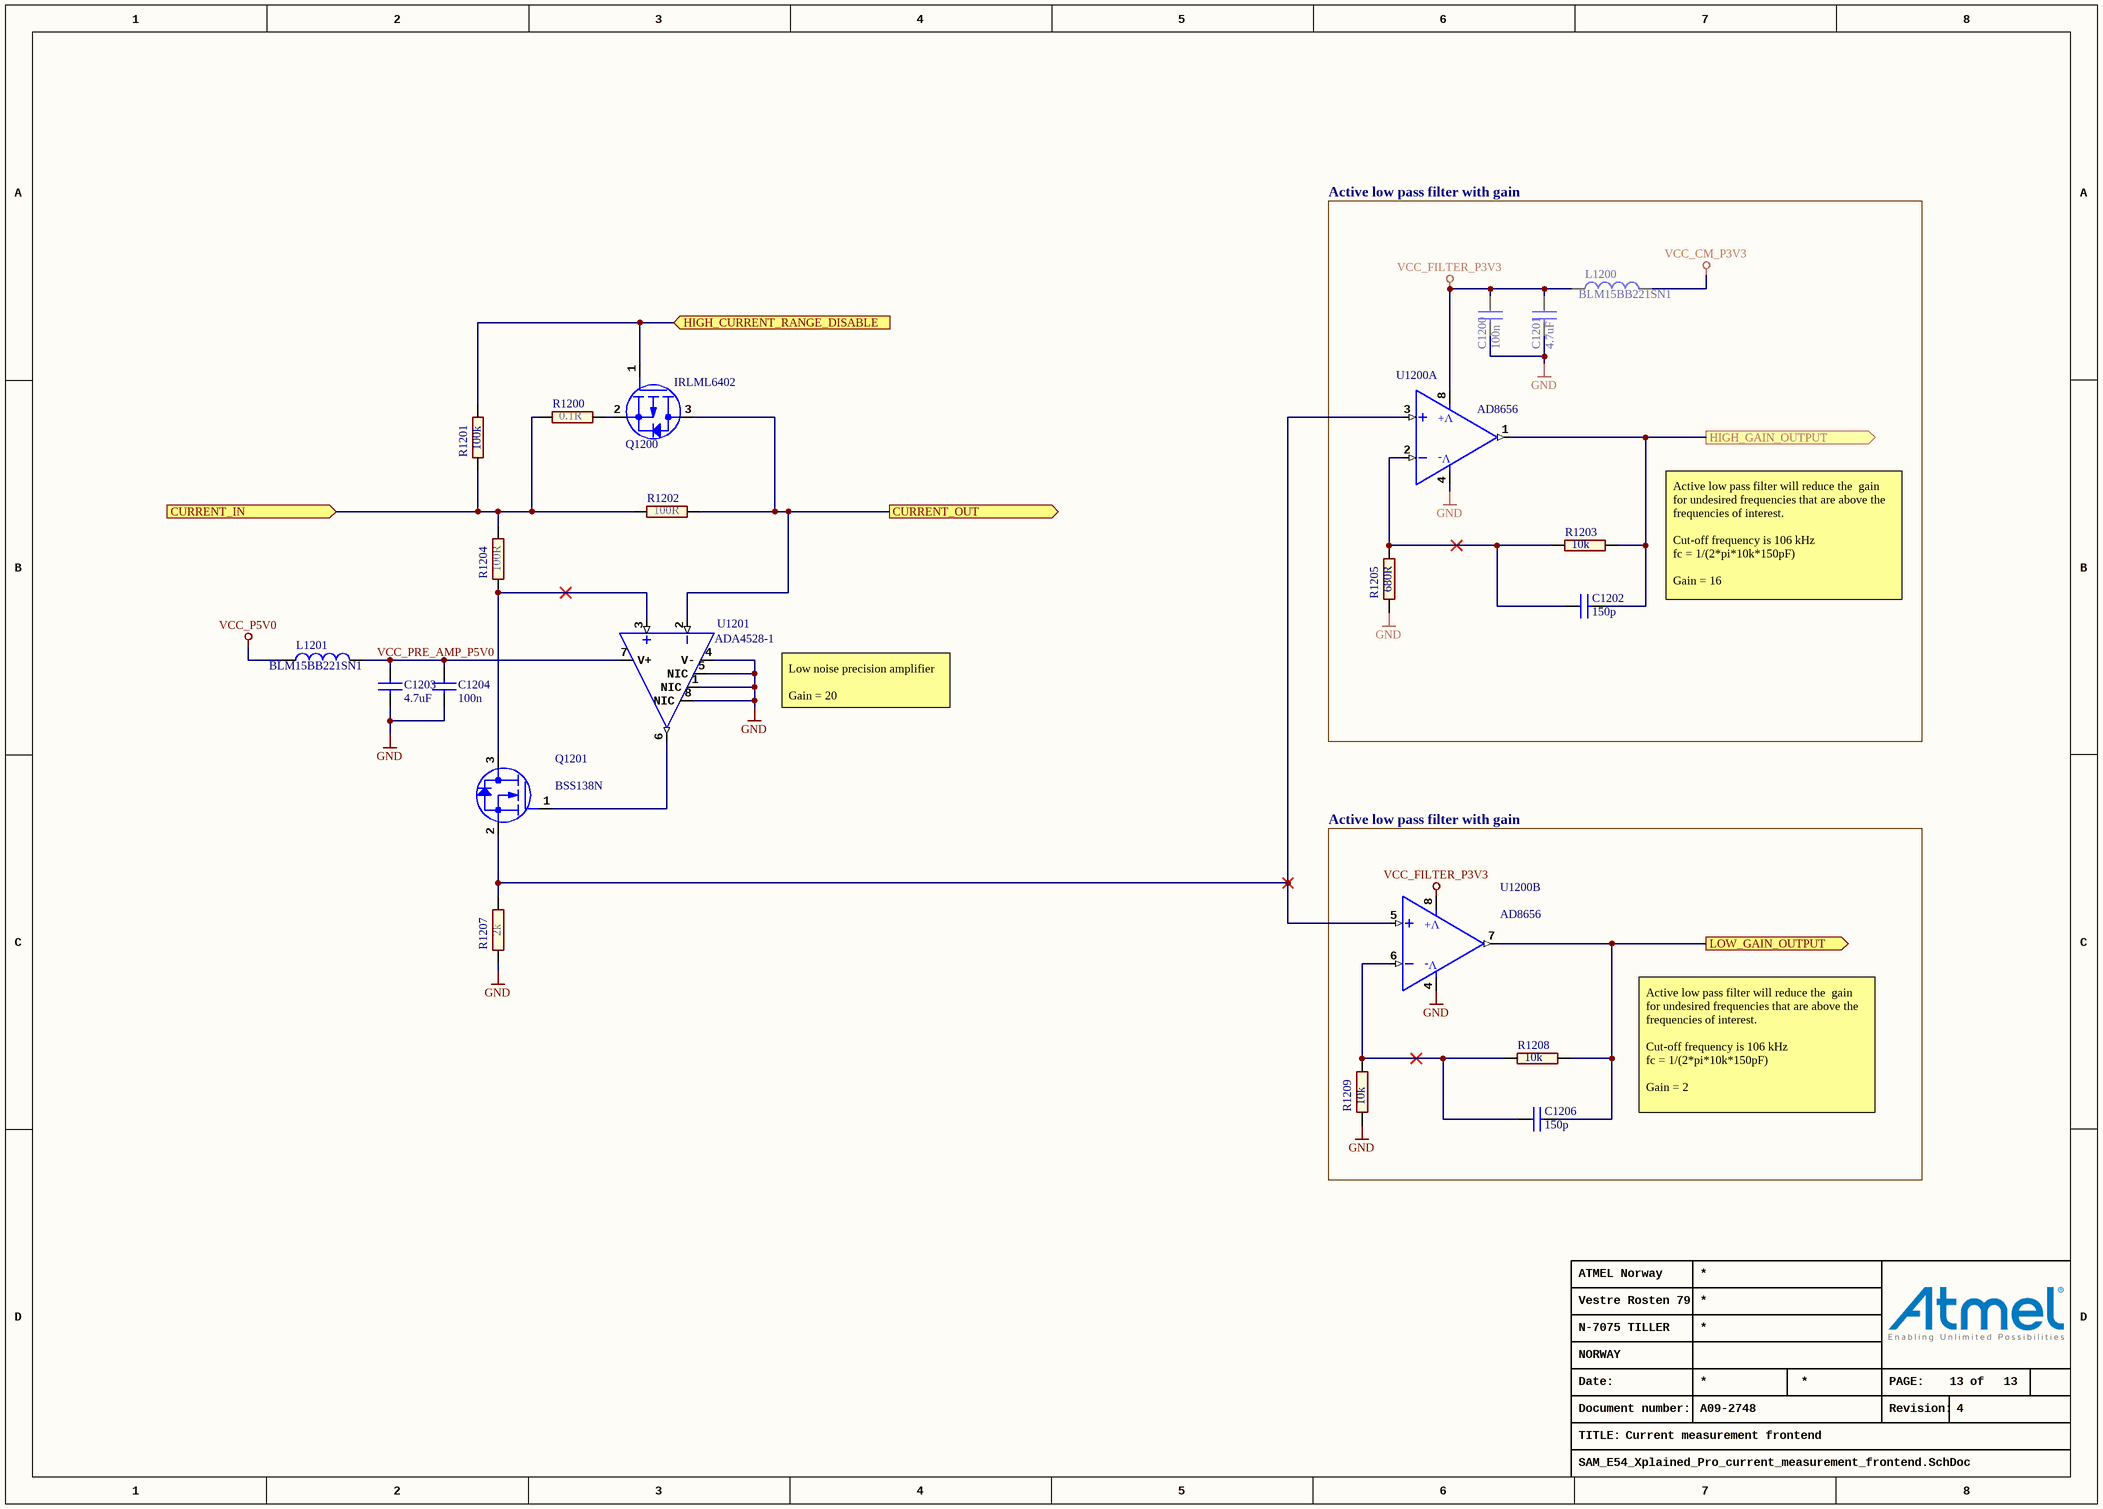
[diagram p8: SAM_E54_Xplained_Pro_current_measurement_frontend.SchDoc]

### Parts
C1200  value 100n  [AP1-00053]
C1201  value 4.7uF  [AP1-00117]
C1202  value 150p  [AP1-00053]
C1203  value 4.7uF  [AP1-00117]
C1204  value 100n  [AP1-00053]
C1206  value 150p  [AP1-00053]
L1200  value BLM15BB221SN1  [AP3-00028]
L1201  value BLM15BB221SN1  [AP3-00028]
Q1200  value IRLML6402  [AP5-00002]
Q1201  value BSS138N  [AP5-00002]
R1200  value 0.1R  [AP2-00076]
R1201  value 100k  [AP2-00011]
R1202  value 100R  [AP2-00076]
R1203  value 10k  [AP2-00011]
R1204  value 100R  [AP2-00076]
R1205  value 680R  [AP2-00011]
R1207  value 2k  [AP2-00011]
R1208  value 10k  [AP2-00011]
R1209  value 10k  [AP2-00011]
U1200  value AD8656  [AP6-00100]  (parts A,B of 2)
U1201  value ADA4528-1  [AP6-00100]

### Blocks framed on the sheet
Active low pass filter with gain: C1200-C1202 L1200 R1203 R1205 U1200
Active low pass filter with gain: C1206 R1208 R1209 U1200

### Ports
CURRENT_IN (in), CURRENT_OUT (out), HIGH_CURRENT_RANGE_DISABLE (in), HIGH_GAIN_OUTPUT (out), LOW_GAIN_OUTPUT (out)

### Nets
GND: C1200.2 C1201.2 C1203.2 C1204.2 R1205.1 R1207.1 R1209.1 U1200.4(V-) U1201.1(NIC) U1201.4(V-) U1201.5(NIC) U1201.8(NIC)
VCC_CM_P3V3: L1200.1
VCC_FILTER_P3V3: C1200.1 C1201.1 L1200.2 U1200.8(V+)
VCC_P5V0: L1201.1
CM_PA05_AIN5: C1206.2 R1208.2 U1200.7(OUTB) ; port LOW_GAIN_OUTPUT
CM_PA08_AIN16: C1202.2 R1203.2 U1200.1(OUTA) ; port HIGH_GAIN_OUTPUT
CM_PA18_CMP0: Q1200.1(G) R1201.2 ; port HIGH_CURRENT_RANGE_DISABLE
VCC_CM_IN_P3V3: R1200.1 R1201.1 R1202.1 R1204.2 ; port CURRENT_IN
VCC_PRE_AMP_P5V0: C1203.1 C1204.1 L1201.2 U1201.7(V+)
NetC1202_1: C1202.1 R1203.1 R1205.2 U1200.2(INA_-)
NetC1206_1: C1206.1 R1208.1 R1209.2 U1200.6(INB_-)
NetQ900_2: Q1200.3(D) R1202.2 U1201.2(IN-) ; port CURRENT_OUT
NetQ1200_2: Q1200.2(S) R1200.2
NetQ1201_1: Q1201.1(G) U1201.6(OUT)
NetQ1201_2: Q1201.2(S) R1207.2 U1200.3(INA_+) U1200.5(INB_+)
NetQ1201_3: Q1201.3(D) R1204.1 U1201.3(IN+)

### Notes on the sheet
- Active low pass filter will reduce the  gain for undesired frequencies that are above the frequencies of interest.
  Cut-off frequency is 106 kHz
  fc = 1/(2*pi*10k*150pF)
  Gain = 16
- Low noise precision amplifier
  Gain = 20
- Active low pass filter will reduce the  gain for undesired frequencies that are above the frequencies of interest.
  Cut-off frequency is 106 kHz
  fc = 1/(2*pi*10k*150pF)
  Gain = 2
- Date:
- PAGE:
- of
- TITLE:
- Document number:
- Revision:

### Library data of the parts
C1200 C1204 = A01-0246: as C1100 on sheet SAM_E54_Xplained_Pro_current_measurement_control; AN: A01-0246; Tolerance: 16V, +/-10%; Height: 0,5
C1201 C1203 = A01-0377: as C100-C102 on sheet SAM_E54_Xplained_Pro_triple_input_power_supply_HSW; AN: A01-0377; Tolerance: 10%; Height: 0,800000011920929
C1202 C1206 = A01-0028: Ceramic capacitor, SMD 0402, X7R, 50V, +/-10%; PartGroup: Capacitors,Ceramic,SMD 0402; Manufacturer: YAGEO CORP; MPN: CC0402KRX7R9BB151; TemperatureRange: -55 - +125 deg C; AN: A01-0028; Tolerance: 50V, +/-10%; Height: 0,550000011920929
L1200 L1201 = A03-0037: SMD RF inductor 0402. Z=220Ohm (@100MHz), Max R(dc)=0.80Ohm, Max current=200mA; PartGroup: Inductors,EMI; Manufacturer: Murata; Tolerance: ±25%; TemperatureRange: -55°C to +125°C; AN: A03-0037; Height: 0,5; MPN: BLM15BB221SN1
Q1200 = A05-0087: P-ch. MOSFET. -30V, -3.7A continuous,RDS(ON)=0.05Ohm@VGS=-4,5V, RDS(ON)=0.08Ohm@VGS=-2.5V; PartGroup: Transistors,Power FET,SMD; Manufacturer: International Rectifier; MPN: IRLML6402PBF; TemperatureRange: -55 - +150 deg C; AN: A05-0087; Height: 1,14999997615814
Q1201 = A05-0140: as Q901 on sheet SAM_E54_Xplained_Pro_current_measurement; AN: A05-0140; Height: 1,10000002384186; MPN: BSS138N
R1200 = A02-0896: WSL0603R1000FEA, metal strip resistor, 0.1 Ohm, +-1%, 0603 SMD, 1/10 W, TEMPCO +-75 ppm/Â°C; PartGroup: Resistors,Sense resistors,SMD Current Sense; Manufacturer: vishay; AN: A02-0896; Height: 0,330000013113022; MPN: WSL0603R1000FEA
R1201 = A02-0260: as R100 on sheet SAM_E54_Xplained_Pro_triple_input_power_supply_HSW; AN: A02-0260; Tolerance: 1 %; Height: 0,349999994039536
R1202 R1204 = A02-0895: ERA-3YEB101V, metal film, 100R Â±0.1%, resistor in 0603 at 100mW, TEMPCO Â±25ppm/Â°C, Max V=75V; PartGroup: Resistors,Metal film,SMD Precision resistors; Manufacturer: Panasonic; MPN: ERA3YEB101V; AN: A02-0895; Height: 0,550000011920929
R1203 R1208 R1209 = A02-0236: Thick film resistor, SMD 0402, 1/16W, 1%; PartGroup: Resistors,SMD,0402 1%; Manufacturer: vishay; MPN: CRCW040210K0FKED; TemperatureRange: -55 - +125 deg C; AN: A02-0236; Tolerance: 1 %; Height: 0,349999994039536
R1205 = A02-0208: Thick film resistor, SMD 0402, 1/16W, 1%; PartGroup: Resistors,SMD,0402 1%; Manufacturer: ASJ; MPN: CR10-6800-FK; TemperatureRange: -55 - +125 deg C; AN: A02-0208; Tolerance: 1 %; Height: 0,349999994039536
R1207 = A02-0219: as R1104 on sheet SAM_E54_Xplained_Pro_current_measurement_control; AN: A02-0219; Tolerance: 1 %; Height: 0,349999994039536
U1200 = A06-1125: AD8656, dual low noise precision OpAmp, rail-to-rail, low offset 250uV, GBP 28 MHz, 8MSOP; PartGroup: Integrated Circuits,General linear,OP-AMP; Manufacturer: Analog Devices; MPN: AD8656ARMZ; TemperatureRange: -40 to +125 deg celcius; AN: A06-1125; Height: 1,10000002384186
U1201 = A06-1134: Precision OpAmp, Zero-Drift 0.015uV/K, ultra low noise 5.6nV/sqrt(Hz), Vo=2uV, GBW=4MHz, single supply 2.2V to 5.5V or dual supply +-1V to +-2.75V, rail to rail, unity gain stable; PartGroup: Integrated Circuits,General linear,OP-AMP; Manufacturer: Analog Devices; MPN: ADA4528-1ARMZ; AN: A06-1134; Height: 1,10000002384186

## Sheet SAM_E54_Xplained_Pro_Ethernet.SchDoc: Ethernet
size A3; Organization: ATMEL Norway; Address1: Vestre Rosten 79; Address2: N-7075 TILLER; Address3: NORWAY; DocumentNumber: A09-2748; Revision: 4; SheetNumber: 7; SheetTotal: 13; PageSetup: Record=PageOptions|CenterHorizontal=True|CenterVertical=True|PrintScale=1.04|XCorrection=1.00|YCorrection=1.00|PrintKind=1|BorderSize=5000000|LeftOffset=0|BottomOffset=0|Orientation=2|PaperLength=1000|PaperWidth=1000|Scale=100|PaperSource=7|PrintQuality=-4|MediaType=1|DitherType=10|PrintScaleMode=1|PaperKind=A3 (297 x 420 mm)|PaperIndex=8
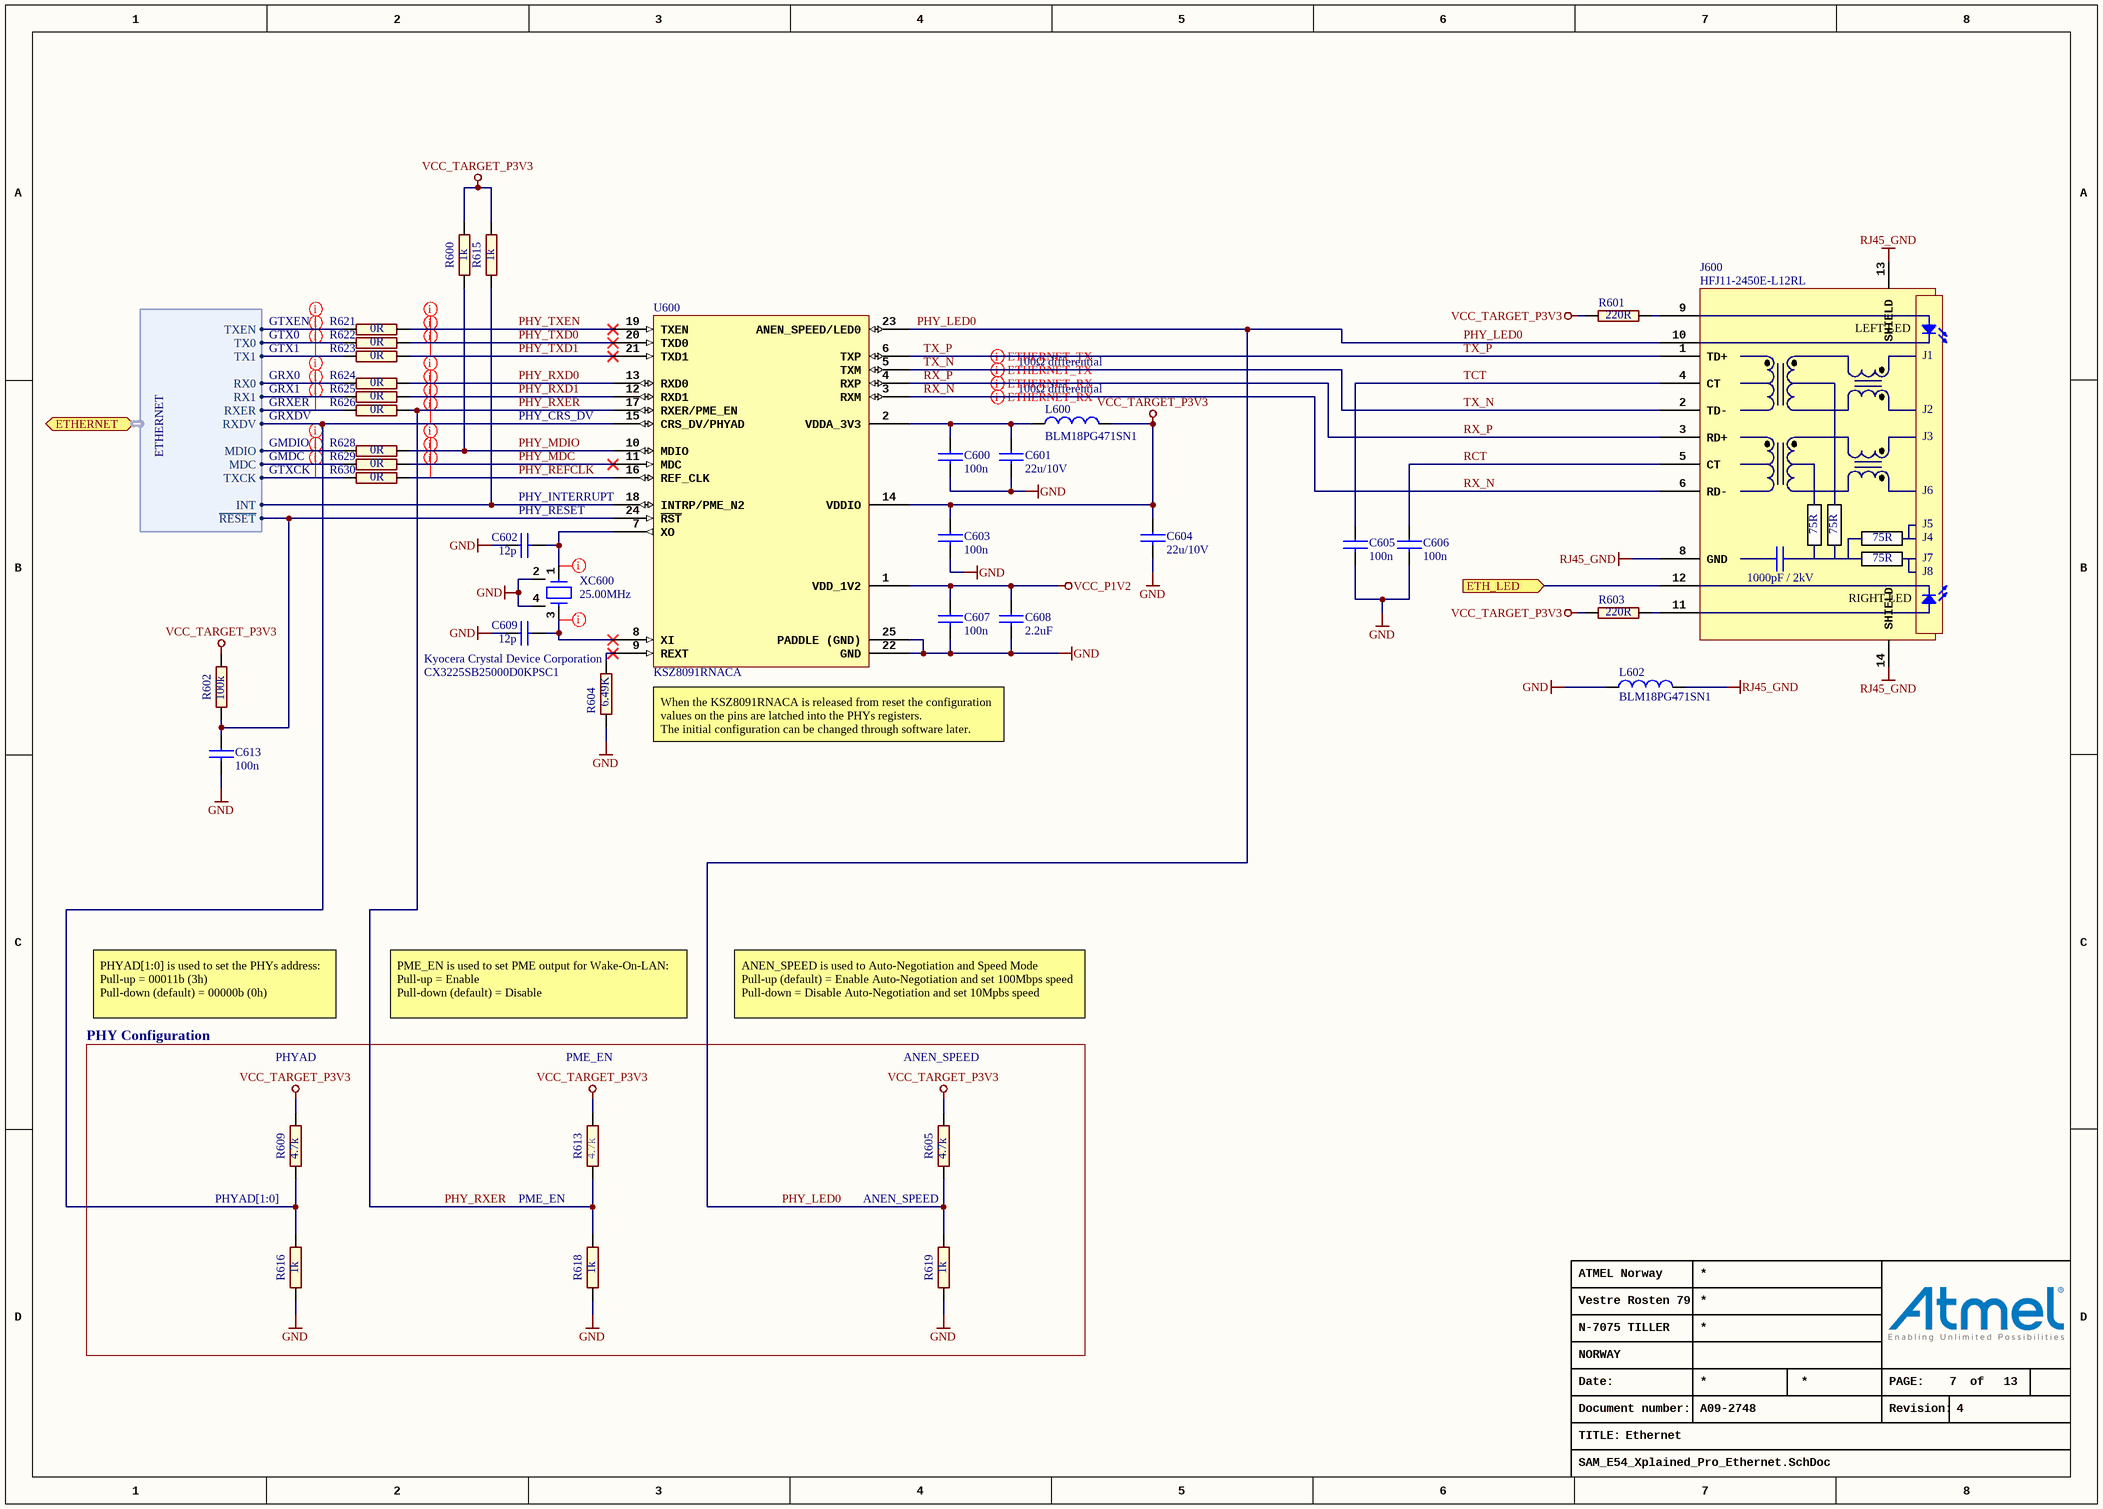
[diagram p9: SAM_E54_Xplained_Pro_Ethernet.SchDoc]

### Parts
C600  value 100n  [AP1-00053]
C601  value 22u/10V  [AP1-00117]
C602  value 12p  [AP1-00053]
C603  value 100n  [AP1-00053]
C604  value 22u/10V  [AP1-00117]
C605  value 100n  [AP1-00053]
C606  value 100n  [AP1-00053]
C607  value 100n  [AP1-00053]
C608  value 2.2uF  [AP1-00053]  (hidden comment: Farnell no: 1288200)
C609  value 12p  [AP1-00053]
C613  value 100n  [AP1-00053]
J600  value HFJ11-2450E-L12RL  [AP8-01033]
L600  value BLM18PG471SN1  [AP3-00005]
L602  value BLM18PG471SN1  [AP3-00005]
R600  value 1k  [AP2-00011]
R601  value 220R  [AP2-00011]
R602  value 100k  [AP2-00011]
R603  value 220R  [AP2-00011]
R604  value 6.49K  [AP2-00011]
R605  value 4.7k  [AP2-00011]
R609  value 4.7k  [AP2-00011]
R613  value 4.7k  [AP2-00011]
R615  value 1k  [AP2-00011]
R616  value 1k  [AP2-00011]
R618  value 1k  [AP2-00011]
R619  value 1k  [AP2-00011]
R621  value 0R  [AP2-00011]
R622  value 0R  [AP2-00011]
R623  value 0R  [AP2-00011]
R624  value 0R  [AP2-00011]
R625  value 0R  [AP2-00011]
R626  value 0R  [AP2-00011]
R628  value 0R  [AP2-00011]
R629  value 0R  [AP2-00011]
R630  value 0R  [AP2-00011]
U600  value KSZ8091RNACA  [AP6-00348]
XC600  value 25.00MHz  Manufacturer: Kyocera Crystal Device Corporation  MPN: CX3225SB25000D0KPSC1  [AP7-00061]

### Blocks framed on the sheet
PHY Configuration: R605 R609 R613 R616 R618 R619

### Ports
ETH_LED (in), ETHERNET (harness ETHERNET)

### Harnesses
ETHERNET: TX0, TX1, TXEN, TXCK, RX0, RX1, MDC, MDIO, RXER, RXDV, INT, ~{RESET}

### Nets
GND: C600.2 C601.2 C602.1 C603.2 C604.2 C605.2 C606.2 C607.2 C608.2 C609.1 C613.2 L602.1 R604.1 R616.1 R618.1 R619.1 U600.22(GND) U600.25(PADDLE_(GND)) XC600.2(GND) XC600.4(GND)
RJ45_GND: J600.8(GND) J600.13(SHIELD) J600.14(SHIELD) L602.2
VCC_P1V2: C607.1 C608.1 U600.1(VDD_1V2)
VCC_TARGET_P3V3: C603.1 C604.1 L600.1 R600.2 R601.2 R602.2 R603.2 R605.2 R609.2 R613.2 R615.2 U600.14(VDDIO)
PA12_ETH_GRX1: R625.2 ; port ETHERNET.RX1
PA13_ETH_GRX0: R624.2 ; port ETHERNET.RX0
PA14_ETH_GTXCK: R630.2 ; port ETHERNET.TXCK
PA15_ETH_GRXER: R626.2 ; port ETHERNET.RXER
PA17_ETH_GTXEN: R621.2 ; port ETHERNET.TXEN
PA18_ETH_GTX0: R622.2 ; port ETHERNET.TX0
PA19_ETH_GTX1: R623.2 ; port ETHERNET.TX1
PC11_ETH_GMDC: R629.2 ; port ETHERNET.MDC
PC12_ETH_GMDIO: R628.2 ; port ETHERNET.MDIO
PC15_ETH_LED: J600.12 ; port ETH_LED
PC20_ETH_GRXDV: R609.1 R616.2 U600.15(CRS_DV/PHYAD) ; port ETHERNET.RXDV
PC21_ETH_RESET: C613.1 R602.1 U600.24(~{RST}) ; port ETHERNET.~{RESET}
PD12_ETH_IRQ: R615.1 U600.18(INTRP/PME_N2) ; port ETHERNET.INT
PHY_LED0: J600.10 R605.1 R619.2 U600.23(ANEN_SPEED/LED0)
PHY_MDC: R629.1 U600.11(MDC)
PHY_MDIO: R600.1 R628.1 U600.10(MDIO)
PHY_REFCLK: R630.1 U600.16(REF_CLK)
PHY_RXD0: R624.1 U600.13(RXD0)
PHY_RXD1: R625.1 U600.12(RXD1)
PHY_RXER: R613.1 R618.2 R626.1 U600.17(RXER/PME_EN)
PHY_TXD0: R622.1 U600.20(TXD0)
PHY_TXD1: R623.1 U600.21(TXD1)
PHY_TXEN: R621.1 U600.19(TXEN)
RCT: C606.1 J600.5(CT)
RX_N: J600.6(RD-) U600.3(RXM)
RX_P: J600.3(RD+) U600.4(RXP)
TCT: C605.1 J600.4(CT)
TX_N: J600.2(TD-) U600.5(TXM)
TX_P: J600.1(TD+) U600.6(TXP)
NetC600_1: C600.1 C601.1 L600.2 U600.2(VDDA_3V3)
NetC602_2: C602.2 U600.7(XO) XC600.1(IN)
NetC609_2: C609.2 U600.8(XI) XC600.3(OUT)
NetJ600_9: J600.9 R601.1
NetJ600_11: J600.11 R603.1
NetR604_2: R604.2 U600.9(REXT)

### Layout directives
differential pair: RX_N, RX_P, TX_N, TX_P
rule Assembly Testpoint Usage [Testpoint - Not Allowed    Multiple - Not Allowed]; rule Fabrication Testpoint Usage [Testpoint - Not Allowed    Multiple - Not Allowed]: NetC602_2, NetC609_2
net class ETHERNET: PA12_ETH_GRX1, PA13_ETH_GRX0, PA14_ETH_GTXCK, PA15_ETH_GRXER, PA17_ETH_GTXEN, PA18_ETH_GTX0, PA19_ETH_GTX1, PC11_ETH_GMDC, PC12_ETH_GMDIO, PC20_ETH_GRXDV, PHY_MDC, PHY_MDIO, PHY_REFCLK, PHY_RXD0, PHY_RXD1, PHY_RXER, PHY_TXD0, PHY_TXD1, PHY_TXEN

### Notes on the sheet
- GTXEN
- GTX0
- GTX1
- GRX0
- 100Ω differential
- GRX1
- GRXER
- GMDIO
- GRXDV
- PHY_CRS_DV
- (near L600) 100Ω differential
- GMDC
- GTXCK
- PHY_INTERRUPT
- (near C602) PHY_RESET
- When the KSZ8091RNACA is released from reset the configuration values on the pins are latched into the PHYs registers.
  The initial configuration can be changed through software later.
- PHYAD[1:0] is used to set the PHYs address:
  Pull-up = 00011b (3h)
  Pull-down (default) = 00000b (0h)
- PME_EN is used to set PME output for Wake-On-LAN:
  Pull-up = Enable
  Pull-down (default) = Disable
- ANEN_SPEED is used to Auto-Negotiation and Speed Mode
  Pull-up (default) = Enable Auto-Negotiation and set 100Mbps speed
  Pull-down = Disable Auto-Negotiation and set 10Mpbs speed
- PHYAD
- PME_EN
- ANEN_SPEED
- PHYAD[1:0]
- Date:
- PAGE:
- of
- TITLE:
- Document number:
- Revision:
- (in symbol A08-2651) LEFT LED; J1; J2; J3; J6; 75R; J5; J4; J7; J8; 1000pF / 2kV; RIGHT LED

### Library data of the parts
C600 C603 C605-C607 C613 = A01-0246: as C1100 on sheet SAM_E54_Xplained_Pro_current_measurement_control; AN: A01-0246; Tolerance: 16V, +/-10%; Height: 0,5
C601 C604 = A01-0791: as C103 on sheet SAM_E54_Xplained_Pro_triple_input_power_supply_HSW; AN: A01-0791; Tolerance: Â±20%
C602 C609 = A01-0016: Ceramic capacitor, SMD 0402, NP0, 50V, +/-5%; PartGroup: Capacitors,Ceramic,SMD 0402; Manufacturer: Kemet; MPN: C0402C120J5GAC7867; TemperatureRange: -55 - +125 deg C; AN: A01-0016; Tolerance: 50V, +/-5%; Height: 0,550000011920929
C608 = A01-0300: Ceramic capacitor, SMD 0402, X5R, 6.3V, +/-20%; PartGroup: Capacitors,Ceramic,SMD 0402; Manufacturer: Kemet; MPN: C0402C225M9PAC; Tolerance: Â±20%; TemperatureRange: -55Â°C to +85Â°C; AN: A01-0300; Height: 0,5
J600 = A08-2651: 10/100Base-TX, THT, RJ45, green and yellow LEDs, integrated magnetics; PartGroup: Mechanical devices,Connectors,Other; Manufacturer: Halo Electronis; TemperatureRange: 0 C to + 70 C; AN: A08-2651; MPN: HFJ11-2450E-L12RL
L600 L602 = A03-0035: as L1100 on sheet SAM_E54_Xplained_Pro_current_measurement_control; AN: A03-0035; Height: 0,800000011920929; MPN: BLM18PG471SN1
R600 R615 R616 R618 R619 = A02-0212: Thick film resistor, SMD 0402, 1/16W, 1%; PartGroup: Resistors,SMD,0402 1%; Manufacturer: ASJ; MPN: CR10-1001-FK; TemperatureRange: -55 - +125 deg C; AN: A02-0212; Tolerance: 1 %; Height: 0,349999994039536
R601 R603 = A02-0196: Thick film resistor, SMD 0402, 1/16W, 1%; PartGroup: Resistors,SMD,0402 1%; Manufacturer: ASJ; MPN: CR10-2200-FK; TemperatureRange: -55 - +125 deg C; AN: A02-0196; Tolerance: 1 %; Height: 0,349999994039536
R602 = A02-0260: as R100 on sheet SAM_E54_Xplained_Pro_triple_input_power_supply_HSW; AN: A02-0260; Tolerance: 1 %; Height: 0,349999994039536
R604 = A02-0761: Thick film resistor, SMD 0402, 1/16W, 1%, E48; PartGroup: Resistors,SMD,0402 1%; Manufacturer: PHYCOMP; MPN: 232270676492L; TemperatureRange: -55 - +125 deg C; AN: A02-0761; Tolerance: 1%; Height: 0,349999994039536
R605 R609 R613 = A02-0228: as R1102 on sheet SAM_E54_Xplained_Pro_current_measurement_control; AN: A02-0228; Tolerance: 1 %; Height: 0,349999994039536
R621-R626 R628-R630 = A02-0163: as R101 on sheet SAM_E54_Xplained_Pro_triple_input_power_supply_HSW; AN: A02-0163; Height: 0,349999994039536
U600 = A06-1460: 10Base-T/100Base-TX PHY, RMII, EEE, WOL, 50MHz clock output; PartGroup: Integrated Circuits,Interface ICs,Ethernet; Manufacturer: Microchip; TemperatureRange: 0 to +70 deg C; AN: A06-1460; Height: 0,850000023841858; MPN: KSZ8091RNACA
XC600 = A07-0149: Kyocera CX3225SB, 25MHz, 8pF, AEC-Q200, SMD crystal; PartGroup: Frequency devices,Crystals,SMD; Tolerance: Â±30ppm; TemperatureRange: -40Â°C to +85Â°C; AN: A07-0149; Height: 0,550000011920929

## Sheet SAM_E54_Xplained_Pro_CAN.SchDoc: CAN
size A3; Organization: ATMEL Norway; Address1: Vestre Rosten 79; Address2: N-7075 TILLER; Address3: NORWAY; DocumentNumber: A09-2748; Revision: 4; SheetNumber: 6; SheetTotal: 13; PageSetup: Record=PageOptions|CenterHorizontal=True|CenterVertical=True|PrintScale=1.01|XCorrection=1.00|YCorrection=1.00|PrintKind=1|BorderSize=5000000|LeftOffset=0|BottomOffset=0|Orientation=2|PaperLength=1000|PaperWidth=1000|Scale=100|PaperSource=7|PrintQuality=-4|MediaType=1|DitherType=10|PaperKind=A3 (297 x 420 mm)|PrintScaleMode=1; ProjectName: SAM3X Xplained Pro
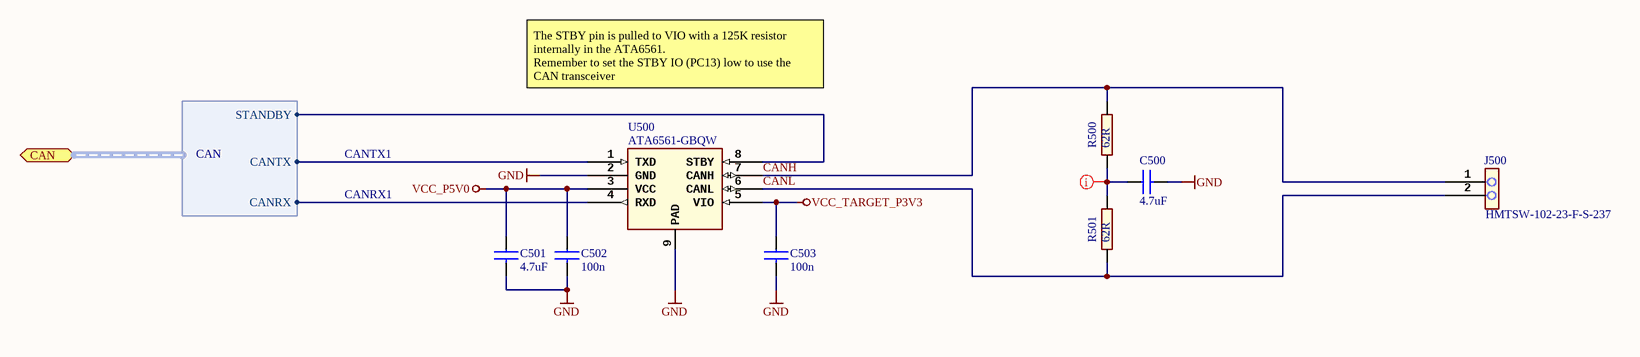
[diagram p10: SAM_E54_Xplained_Pro_CAN.SchDoc]

### Parts
C500  value 4.7uF  [AP1-00003]
C501  value 4.7uF  [AP1-00117]
C502  value 100n  [AP1-00001]
C503  value 100n  [AP1-00001]
J500  value HMTSW-102-23-F-S-237  [AP8-00733]
R500  value 62R  [AP2-00008]  (hidden comment: Generic component)
R501  value 62R  [AP2-00008]  (hidden comment: Generic component)
U500  value ATA6561-GBQW  [AP6-00407]

### Ports
CAN (harness CAN)

### Harnesses
CAN: CANTX, CANRX, STANDBY

### Nets
GND: C500.2 C501.2 C502.2 C503.2 U500.2(GND) U500.9(PAD)
VCC_P5V0: C501.1 C502.1 U500.3(VCC)
VCC_TARGET_P3V3: C503.1 U500.5(VIO)
CANH: J500.1 R500.2 U500.7(CANH)
CANL: J500.2 R501.1 U500.6(CANL)
PB12_CAN1_TX: U500.1(TXD) ; port CAN.CANTX
PB13_CAN1_RX: U500.4(RXD) ; port CAN.CANRX
PC13_CAN_STBY: U500.8(STBY) ; port CAN.STANDBY
NetC500_1: C500.1 R500.1 R501.2

### Layout directives
rule Fabrication Testpoint Usage [Testpoint - Not Allowed    Multiple - Not Allowed]; rule Assembly Testpoint Usage [Testpoint - Not Allowed    Multiple - Not Allowed]: NetC500_1

### Notes on the sheet
- The STBY pin is pulled to VIO with a 125K resistor internally in the ATA6561.
  Remember to set the STBY IO (PC13) low to use the CAN transceiver
- CANTX1
- CANRX1
- Date:
- PAGE:
- of
- TITLE:
- Document number:
- Revision:

### Library data of the parts
C500 = A01-0400: Ceramic capacitor, SMD 0805, X5R, 25V, Â±10 %; PartGroup: Capacitors,Ceramic,SMD 0805; Manufacturer: Murata; MPN: GRM21BR61E475KA12L; Tolerance: Â±10%; AN: A01-0400; Height: 1,25
C501 = A01-0377: as C100-C102 on sheet SAM_E54_Xplained_Pro_triple_input_power_supply_HSW; AN: A01-0377; Tolerance: 10%; Height: 0,800000011920929
C502 C503 = A01-0246: as C1100 on sheet SAM_E54_Xplained_Pro_current_measurement_control; AN: A01-0246; Tolerance: 16V, +/-10%; Height: 0,5
J500 = A08-1754: 1x2 pin header, 2.54mm pitch, Pin-in-Paste THM; PartGroup: Mechanical devices,Connectors,Pin headers; Manufacturer: SAMTEC; TemperatureRange: - 55 deg C to + 125 deg C; AN: A08-1754; Height: 6,09999990463257; MPN: HMTSW-102-23-F-S-237
R500 R501 = A02-0760: Thick film resistor, SMD 1210, 0.5W, 1%; PartGroup: Resistors,SMD,1210 1%; Manufacturer: vishay; MPN: CRCW121062R0FKEAHP; TemperatureRange: -55°C to +155°C; AN: A02-0760; Tolerance: 1%; Height: 0,699999988079071
U500 = A06-1172: 5Mbit/s CAN Trasceiver,VCC = 5V, VIO = 2.8-5V, 3x3 mm VDFN8; PartGroup: Integrated Circuits,Interface ICs,CAN; Manufacturer: ATMEL; AN: A06-1172; Height: 0,899999976158142; MPN: ATA6561-GBQW

## Sheet SAM_E54_Xplained_Pro_Memory.SchDoc: Memory
size A3; Organization: ATMEL Norway; Address1: Vestre Rosten 79; Address2: N-7075 TILLER; Address3: NORWAY; DocumentNumber: A09-2748; Revision: 4; SheetNumber: 8; SheetTotal: 13; PageSetup: Record=PageOptions|CenterHorizontal=True|CenterVertical=True|PrintScale=1.01|XCorrection=1.00|YCorrection=1.00|PrintKind=1|BorderSize=5000000|LeftOffset=0|BottomOffset=0|Orientation=2|PaperLength=1000|PaperWidth=1000|Scale=100|PaperSource=7|PrintQuality=-4|MediaType=1|DitherType=10|PaperKind=A3 (297 x 420 mm)|PrintScaleMode=1
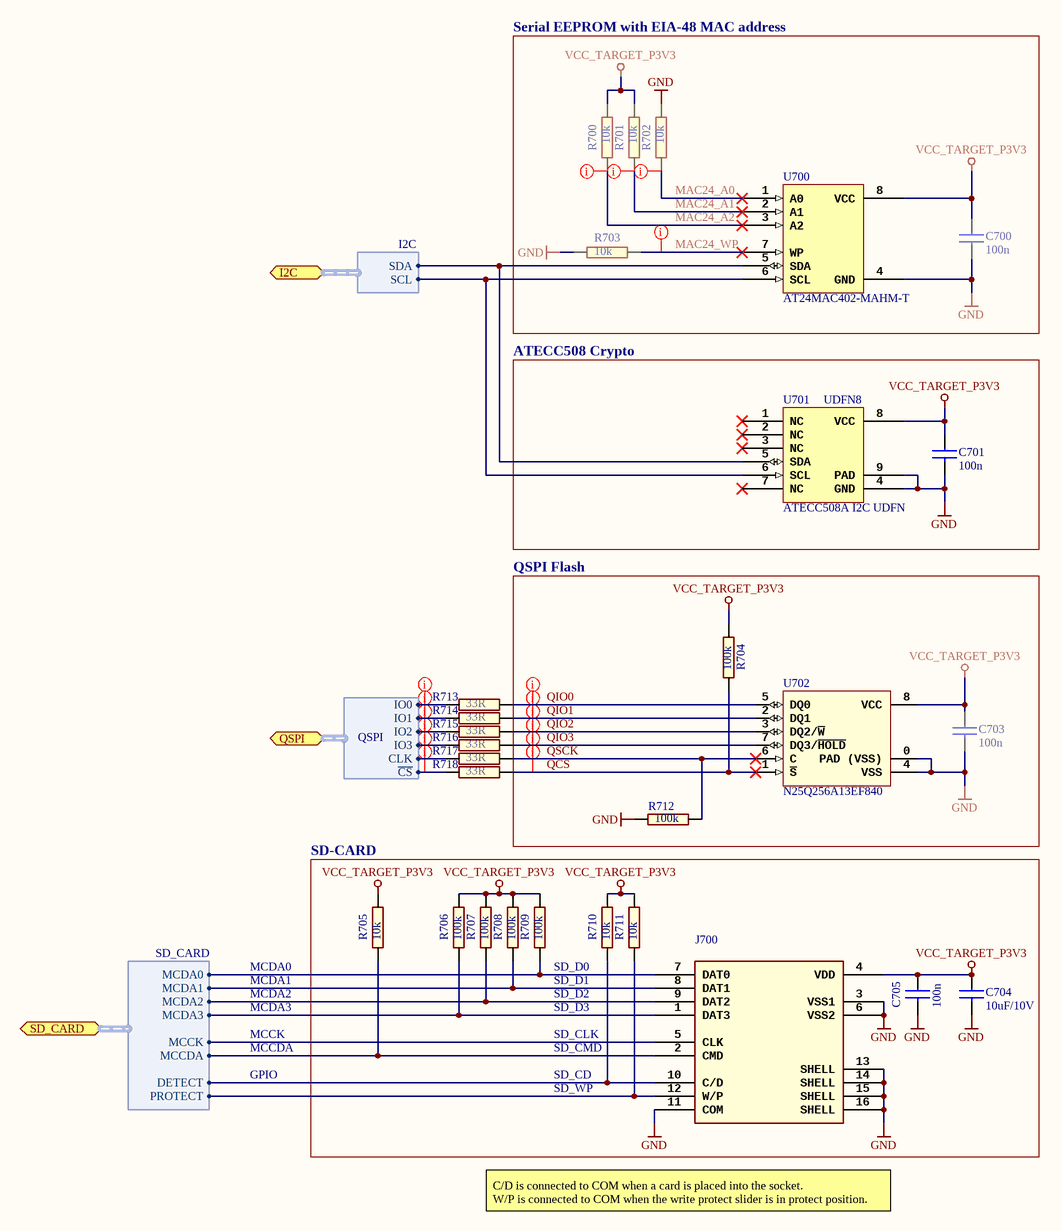
[diagram p11: SAM_E54_Xplained_Pro_Memory.SchDoc]

### Parts
C700  value 100n  [AP1-00053]
C701  value 100n  [AP1-00053]
C703  value 100n  [AP1-00053]
C704  value 10uF/10V  [AP1-00117]
C705  value 100n  [AP1-00053]
J700  (no value)  [AP8-00377]
R700  value 10k  [AP2-00011]
R701  value 10k  [AP2-00011]
R702  value 10k  [AP2-00011]
R703  value 10k  [AP2-00011]
R704  value 100k  [AP2-00011]
R705  value 10k  [AP2-00011]
R706  value 100k  [AP2-00011]
R707  value 100k  [AP2-00011]
R708  value 100k  [AP2-00011]
R709  value 100k  [AP2-00011]
R710  value 10k  [AP2-00011]
R711  value 10k  [AP2-00011]
R712  value 100k  [AP2-00011]
R713  value 33R  [AP2-00011]
R714  value 33R  [AP2-00011]
R715  value 33R  [AP2-00011]
R716  value 33R  [AP2-00011]
R717  value 33R  [AP2-00011]
R718  value 33R  [AP2-00011]
U700  value AT24MAC402-MAHM-T  [AP6-00186]
U701  value ATECC508A I2C UDFN  [AP6-00409]
U702  value N25Q256A13EF840  [AP6-00478]  (hidden comment: Supports XIP, single, dual and quad I/O operation)

### Blocks framed on the sheet
Serial EEPROM with EIA-48 MAC address: C700 R700-R703 U700
ATECC508 Crypto: C701 U701
QSPI Flash: C703 R704 R712 U702
SD-CARD: C704 C705 J700 R705-R711

### Ports
I2C (harness I2C), QSPI (harness QSPI), SD_CARD (harness SD_CARD)

### Harnesses
SD_CARD: MCCDA, MCCK, MCDA3, MCDA2, MCDA1, MCDA0, DETECT, PROTECT
QSPI: CLK, IO3, IO2, IO0, IO1, ~{CS}
I2C: SDA, SCL

### Nets
GND: C700.2 C701.2 C703.2 C704.2 C705.2 J700.3(VSS1) J700.6(VSS2) J700.11(COM) J700.13(SHELL) J700.14(SHELL) J700.15(SHELL) J700.16(SHELL) R702.2 R703.1 R712.1 U700.4(GND) U701.4(GND) U701.9(PAD) U702.0(PAD_(VSS)) U702.4(VSS)
VCC_TARGET_P3V3: C700.1 C701.1 C703.1 C704.1 C705.1 J700.4(VDD) R700.2 R701.2 R704.2 R705.2 R706.2 R707.2 R708.2 R709.2 R710.2 R711.2 U700.8(VCC) U701.8(VCC) U702.8(VCC)
MAC24_A0: R702.1 U700.1(A0)
MAC24_A1: R701.1 U700.2(A1)
MAC24_A2: R700.1 U700.3(A2)
MAC24_WP: R703.2 U700.7(WP)
PA08_QSPI_DATA0: R713.2 ; port QSPI.IO0
PA09_QSPI_DATA1: R714.2 ; port QSPI.IO1
PA10_QSPI_DATA2: R715.2 ; port QSPI.IO2
PA11_QSPI_DATA3: R716.2 ; port QSPI.IO3
PA20_SDHC_CMD: J700.2(CMD) R705.1 ; port SD_CARD.MCCDA
PA21_SDHC_CK: J700.5(CLK) ; port SD_CARD.MCCK
PB10_QSPI_SCK: R717.2 ; port QSPI.CLK
PB11_QSPI_CS: R718.2 ; port QSPI.~{CS}
PB18_SDHC_DATA0: J700.7(DAT0) R709.1 ; port SD_CARD.MCDA0
PB19_SDHC_DATA1: J700.8(DAT1) R708.1 ; port SD_CARD.MCDA1
PB20_SDHC_DATA2: J700.9(DAT2) R707.1 ; port SD_CARD.MCDA2
PB21_SDHC_DATA3: J700.1(DAT3) R706.1 ; port SD_CARD.MCDA3
PD08_S7P0_I2C_SDA: U700.5(SDA) U701.5(SDA) ; port I2C.SDA
PD09_S7P1_I2C_SCL: U700.6(SCL) U701.6(SCL) ; port I2C.SCL
PD20_SDHC_CD: J700.10(C/D) R710.1 ; port SD_CARD.DETECT
PD21_SDHC_WP: J700.12(W/P) R711.1 ; port SD_CARD.PROTECT
QCS: R704.1 R718.1 U702.1(~{S})
QIO0: R713.1 U702.5(DQ0)
QIO1: R714.1 U702.2(DQ1)
QIO2: R715.1 U702.3(DQ2/~{W})
QIO3: R716.1 U702.7(DQ3/~{HOLD})
QSCK: R712.2 R717.1 U702.6(C)

Not connected (* = marked no-connect by the designer): U701 1(NC)* 2(NC)* 3(NC)* 7(NC)*

### Layout directives
rule Assembly Testpoint Usage [Testpoint - Not Allowed    Multiple - Not Allowed]; rule Fabrication Testpoint Usage [Testpoint - Not Allowed    Multiple - Not Allowed]: MAC24_A0, MAC24_A1, MAC24_A2, MAC24_WP
net class QSPI: QCS, QIO0, QIO1, QIO2, QIO3, QSCK
rule Assembly Testpoint Usage [Testpoint - Not Allowed    Multiple - Not Allowed]; rule Fabrication Testpoint Usage [Testpoint - Not Allowed    Multiple - Not Allowed]; net class QSPI_MCU: PA08_QSPI_DATA0, PA09_QSPI_DATA1, PA10_QSPI_DATA2, PA11_QSPI_DATA3, PB10_QSPI_SCK, PB11_QSPI_CS

### Notes on the sheet
- (near U701) UDFN8
- MCDA0
- MCDA1
- MCDA2
- MCDA3
- SD_D0
- SD_D1
- SD_D2
- SD_D3
- GPIO
- MCCK
- MCCDA
- SD_CLK
- SD_CMD
- SD_CD
- SD_WP
- C/D is connected to COM when a card is placed into the socket.
  W/P is connected to COM when the write protect slider is in protect position.
- Date:
- PAGE:
- of
- TITLE:
- Document number:
- Revision:

### Library data of the parts
C700 C701 C703 C705 = A01-0246: as C1100 on sheet SAM_E54_Xplained_Pro_current_measurement_control; AN: A01-0246; Tolerance: 16V, +/-10%; Height: 0,5
C704 = A01-0461: Ceramic capacitor, SMD 0603, X5R, 10V, 10UF Â± 20%; PartGroup: Capacitors,Ceramic,SMD 0603; Manufacturer: AVX; MPN: 0603ZD106MAT2A; Tolerance: Â± 20%; TemperatureRange: -55Â°C to +85Â°C; AN: A01-0461
J700 = A08-0816: SD/MMC socket, 2.7mm, push-push, SMD; PartGroup: Mechanical devices,Connectors,Memory cards; Manufacturer: Kyocera-elco; Value: KYOCERA - 14 5738 009 220 859+; TemperatureRange: -25 deg C to 90 deg C; AN: A08-0816; Height: 2,70000004768372; MPN: KYOCERA - 14 5738 009 220 859+
R700-R703 R705 R710 R711 = A02-0236: as R1203 on sheet SAM_E54_Xplained_Pro_current_measurement_frontend; AN: A02-0236; Tolerance: 1 %; Height: 0,349999994039536
R704 R706-R709 R712 = A02-0260: as R100 on sheet SAM_E54_Xplained_Pro_triple_input_power_supply_HSW; AN: A02-0260; Tolerance: 1 %; Height: 0,349999994039536
R713-R718 = A02-0176: Thick film resistor, SMD 0402, 1/16W, 1%; PartGroup: Resistors,SMD,0402 1%; Manufacturer: ASJ; MPN: CR10-33R0-FK; TemperatureRange: -55 - +125 deg C; AN: A02-0176; Tolerance: 1 %; Height: 0,349999994039536
U700 = A06-1169: 2kbit I2C EEPROM, single EUI-48 MAC, 1.7-5.5V, 2x3mm UDFN (8MA2); PartGroup: Integrated Circuits,Memory,EEPROM; Manufacturer: ATMEL; TemperatureRange: â€“40Â°C to +85Â°C; AN: A06-1169; Height: 0,600000023841858; MPN: AT24MAC402-MAHM-T
U701 = A06-1281: ATECC508A with an I2C Interface and a 8 Pin UDFN Package with Paddle; PartGroup: Integrated Circuits,Special function,Encryption; Manufacturer: ATMEL; MPN: ATECC508A-MAHDA-T; AN: A06-1281; Height: 0,600000023841858
U702 = A06-1459: 256 Mbit (32MB) QSPI flash, 3.3V, 108MHz, V-PDFN-8 (8x6mm); PartGroup: Integrated Circuits,Memory,FLASH; Manufacturer: Micron; MPN: N25Q256A13EF840F; TemperatureRange: â€“40Â°C to 85Â°C; AN: A06-1459; Height: 0,850000023841858